# EAGLE design robotic_arm (EAGLE 9.3.1)
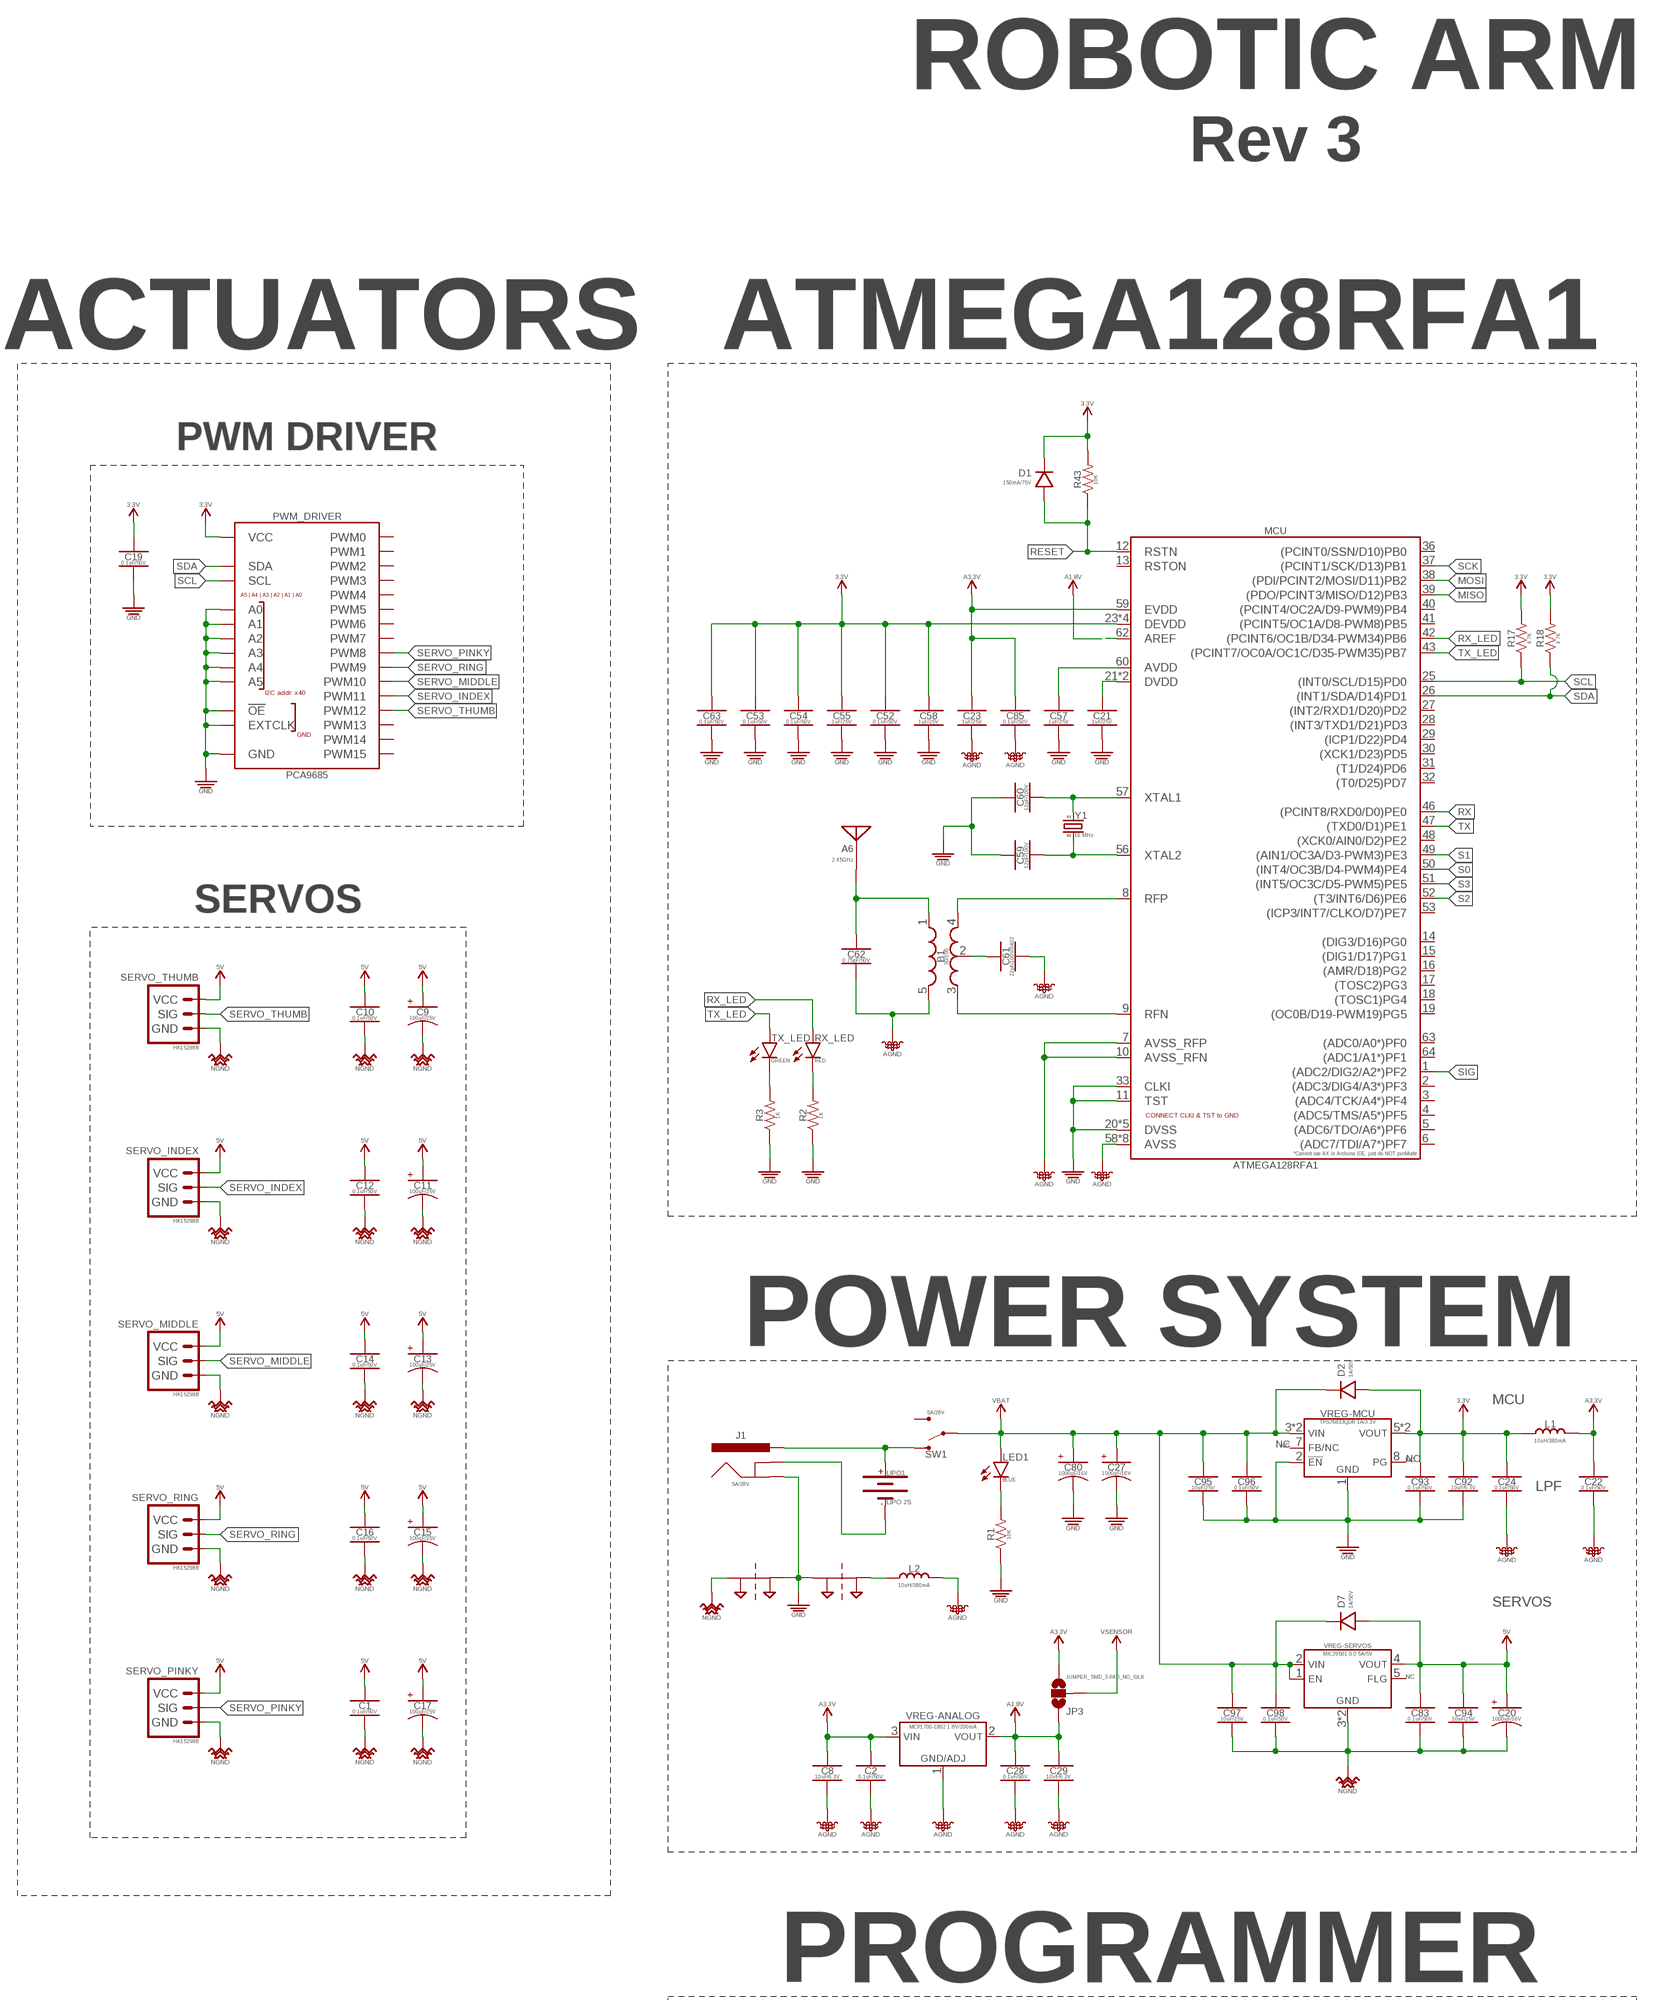
[diagram p0: schematic, sheet 1, part 1 of 3]
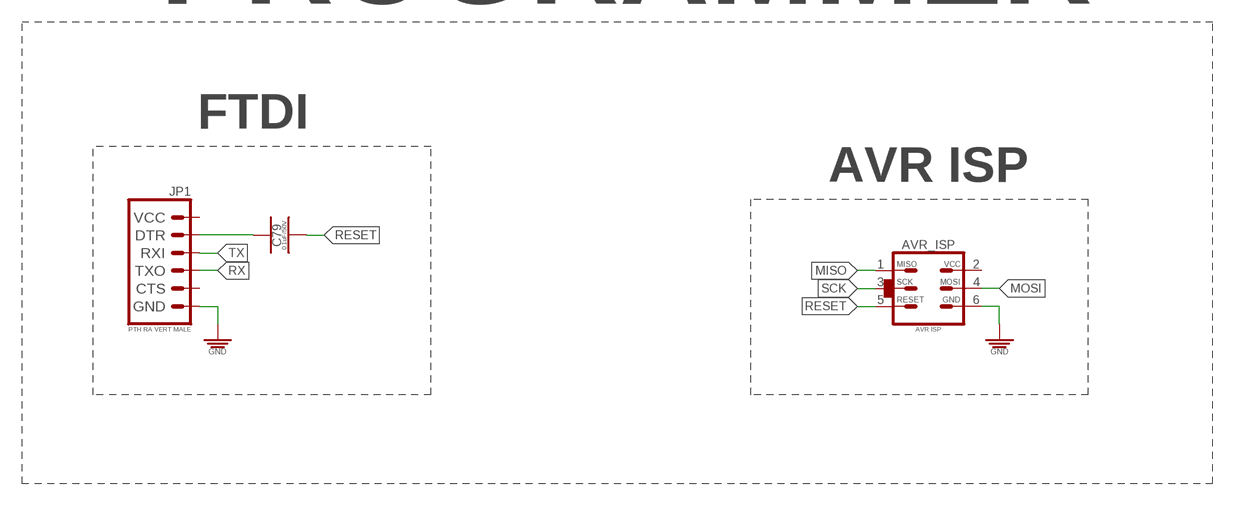
[diagram p1: schematic, sheet 1, part 2 of 3]
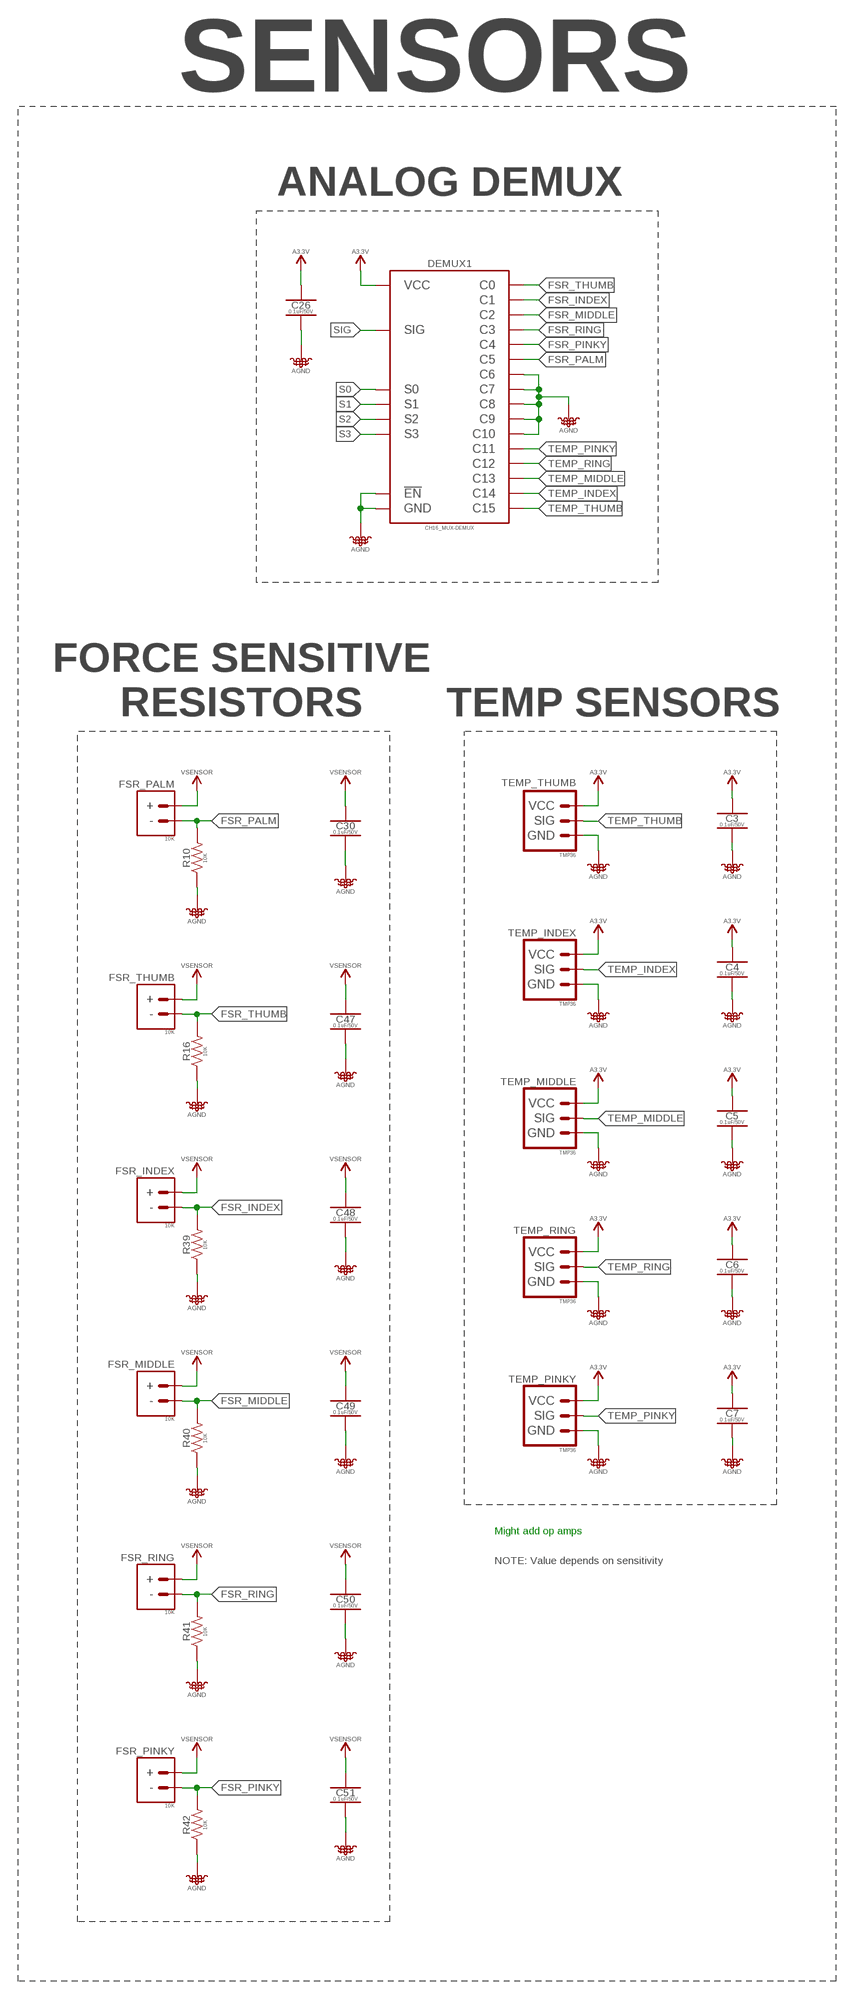
[diagram p2: schematic, sheet 1, part 3 of 3]

## Parts
A6  2.45GHz  ANTENNA_SMD_CHP-2.45GHZ-0.5DBI-3W  [ANTC6522X100]
AVR_ISP  AVR ISP  AVR_SPI_PRG_6_PTH_VERT_MALE_2.54MM  [HDRV6W64P254_2X3_762X508X838B]
B1  50/100  BALUN_SMD-0805_UNBAL/BAL-50/100  [RESCAXE65P200X125X95-6]
C1  0.1uF/50V  0.1UF_SMD-0402_50V-10%  [CAPC1005X55_SMD-0402]
C2  0.1uF/50V  0.1UF_SMD-0402_50V-10%  [CAPC1005X55_SMD-0402]
C3  0.1uF/50V  0.1UF_SMD-0402_50V-10%  [CAPC1005X55_SMD-0402]
C4  0.1uF/50V  0.1UF_SMD-0402_50V-10%  [CAPC1005X55_SMD-0402]
C5  0.1uF/50V  0.1UF_SMD-0402_50V-10%  [CAPC1005X55_SMD-0402]
C6  0.1uF/50V  0.1UF_SMD-0402_50V-10%  [CAPC1005X55_SMD-0402]
C7  0.1uF/50V  0.1UF_SMD-0402_50V-10%  [CAPC1005X55_SMD-0402]
C8  10uF/6.3V  10UF_CER_SMD-0402_6.3V-20%  [CAPC1005X55_SMD-0402]
C9  100uF/25V  100UF-POLARIZED_PTH_25V-20%_D5-LS2-H11  [CAPPRD200W50D500H1100B]
C10  0.1uF/50V  0.1UF_SMD-0402_50V-10%  [CAPC1005X55_SMD-0402]
C11  100uF/25V  100UF-POLARIZED_PTH_25V-20%_D5-LS2-H11  [CAPPRD200W50D500H1100B]
C12  0.1uF/50V  0.1UF_SMD-0402_50V-10%  [CAPC1005X55_SMD-0402]
C13  100uF/25V  100UF-POLARIZED_PTH_25V-20%_D5-LS2-H11  [CAPPRD200W50D500H1100B]
C14  0.1uF/50V  0.1UF_SMD-0402_50V-10%  [CAPC1005X55_SMD-0402]
C15  100uF/25V  100UF-POLARIZED_PTH_25V-20%_D5-LS2-H11  [CAPPRD200W50D500H1100B]
C16  0.1uF/50V  0.1UF_SMD-0402_50V-10%  [CAPC1005X55_SMD-0402]
C17  100uF/25V  100UF-POLARIZED_PTH_25V-20%_D5-LS2-H11  [CAPPRD200W50D500H1100B]
C19  0.1uF/50V  0.1UF_SMD-0402_50V-10%  [CAPC1005X55_SMD-0402]
C20  1000uF/16V  1000UF-POLARIZED_PTH_16V-20%_D8-LS3.5-H20  [CAPPRD350W60D800H2000B]
C21  1uF/25V  1UF_CER_SMD-0402_25V-10%  [CAPC1005X55_SMD-0402]
C22  0.1uF/50V  0.1UF_SMD-0402_50V-10%  [CAPC1005X55_SMD-0402]
C23  1uF/25V  1UF_CER_SMD-0402_25V-10%  [CAPC1005X55_SMD-0402]
C24  0.1uF/50V  0.1UF_SMD-0402_50V-10%  [CAPC1005X55_SMD-0402]
C26  0.1uF/50V  0.1UF_SMD-0402_50V-10%  [CAPC1005X55_SMD-0402]
C27  1000uF/16V  1000UF-POLARIZED_PTH_16V-20%_D8-LS3.5-H20  [CAPPRD350W60D800H2000B]
C28  0.1uF/50V  0.1UF_SMD-0402_50V-10%  [CAPC1005X55_SMD-0402]
C29  10uF/6.3V  10UF_CER_SMD-0402_6.3V-20%  [CAPC1005X55_SMD-0402]
C30  0.1uF/50V  0.1UF_SMD-0402_50V-10%  [CAPC1005X55_SMD-0402]
C47  0.1uF/50V  0.1UF_SMD-0402_50V-10%  [CAPC1005X55_SMD-0402]
C48  0.1uF/50V  0.1UF_SMD-0402_50V-10%  [CAPC1005X55_SMD-0402]
C49  0.1uF/50V  0.1UF_SMD-0402_50V-10%  [CAPC1005X55_SMD-0402]
C50  0.1uF/50V  0.1UF_SMD-0402_50V-10%  [CAPC1005X55_SMD-0402]
C51  0.1uF/50V  0.1UF_SMD-0402_50V-10%  [CAPC1005X55_SMD-0402]
C52  0.1uF/50V  0.1UF_SMD-0402_50V-10%  [CAPC1005X55_SMD-0402]
C53  0.1uF/50V  0.1UF_SMD-0402_50V-10%  [CAPC1005X55_SMD-0402]
C54  0.1uF/50V  0.1UF_SMD-0402_50V-10%  [CAPC1005X55_SMD-0402]
C55  1uF/25V  1UF_CER_SMD-0402_25V-10%  [CAPC1005X55_SMD-0402]
C57  1uF/25V  1UF_CER_SMD-0402_25V-10%  [CAPC1005X55_SMD-0402]
C58  1uF/25V  1UF_CER_SMD-0402_25V-10%  [CAPC1005X55_SMD-0402]
C59  12pF/100V  12PF_SMD-0402_100V-5%  [CAPC1005X55_SMD-0402]
C60  12pF/100V  12PF_SMD-0402_100V-5%  [CAPC1005X55_SMD-0402]
C61  22pF/100V/0402  22PF_CER_SMD-0402-100V-5%  [CAPC1005X55_SMD-0402]
C62  0.75pF/50V  0.75PF_CER_SMD-0402_50V-33%  [CAPC1005X55_SMD-0402]
C63  0.1uF/50V  0.1UF_SMD-0402_50V-10%  [CAPC1005X55_SMD-0402]
C79  0.1uF/50V  0.1UF_SMD-0402_50V-10%  [CAPC1005X55_SMD-0402]
C80  1000uF/16V  1000UF-POLARIZED_PTH_16V-20%_D8-LS3.5-H20  [CAPPRD350W60D800H2000B]
C83  0.1uF/50V  0.1UF_SMD-0402_50V-10%  [CAPC1005X55_SMD-0402]
C85  0.1uF/50V  0.1UF_SMD-0402_50V-10%  [CAPC1005X55_SMD-0402]
C92  10uF/6.3V  10UF_CER_SMD-0402_6.3V-20%  [CAPC1005X55_SMD-0402]
C93  0.1uF/50V  0.1UF_SMD-0402_50V-10%  [CAPC1005X55_SMD-0402]
C94  10uF/25V  10UF_CER_SMD-0805_25V-10%  [CAPC2012X95_SMD-0805]
C95  10uF/25V  10UF_CER_SMD-0805_25V-10%  [CAPC2012X95_SMD-0805]
C96  0.1uF/50V  0.1UF_SMD-0402_50V-10%  [CAPC1005X55_SMD-0402]
C97  10uF/25V  10UF_CER_SMD-0805_25V-10%  [CAPC2012X95_SMD-0805]
C98  0.1uF/50V  0.1UF_SMD-0402_50V-10%  [CAPC1005X55_SMD-0402]
D1  150mA/75V  GENERAL-PURPOSE_SMD-0402_GP_150MA-75V  [DFN100X60X55-2]
D2  1A/50V  GENERAL-PURPOSE_SMD_GP_1A-50V  [SODFL3516X170]
D7  1A/50V  GENERAL-PURPOSE_SMD_GP_1A-50V  [SODFL3516X170]
DEMUX1  CH16_MUX-DEMUX  CD74HC4067-SM96_16:1_MUX-DEMUX_SOP-24_16:1-MUX-DEMUX  [SOP65P780X200-24]
FSR_INDEX  10K  FORCE-SENSITIVE-RESISTOR_SENSOR_FSR-5MM_0530470210_VERT-MALE_PITCH-1.25MM  [_MOLEX-0530470210_VERT_PITCH-1.25MM]
FSR_MIDDLE  10K  FORCE-SENSITIVE-RESISTOR_SENSOR_FSR-5MM_0530470210_VERT-MALE_PITCH-1.25MM  [_MOLEX-0530470210_VERT_PITCH-1.25MM]
FSR_PALM  10K  FORCE-SENSITIVE-RESISTOR_SENSOR_FSR-5MM_0530470210_VERT-MALE_PITCH-1.25MM  [_MOLEX-0530470210_VERT_PITCH-1.25MM]
FSR_PINKY  10K  FORCE-SENSITIVE-RESISTOR_SENSOR_FSR-5MM_0530470210_VERT-MALE_PITCH-1.25MM  [_MOLEX-0530470210_VERT_PITCH-1.25MM]
FSR_RING  10K  FORCE-SENSITIVE-RESISTOR_SENSOR_FSR-5MM_0530470210_VERT-MALE_PITCH-1.25MM  [_MOLEX-0530470210_VERT_PITCH-1.25MM]
FSR_THUMB  10K  FORCE-SENSITIVE-RESISTOR_SENSOR_FSR-5MM_0530470210_VERT-MALE_PITCH-1.25MM  [_MOLEX-0530470210_VERT_PITCH-1.25MM]
J1  5A/28V  POWER_JACK-BARREL_ID2.1MM-OD5.5MM_PTH_ID2.1MM-OD5.5MM  [POWER_JACK_PTH_ID2.1MM-OD5.5MM]
JP1  PTH RA VERT MALE  FTDI_PTH_RA_MALE_2.54MM  [HDRRA6W64P254_1X6_1524X254X254B_FTDI]
JP3  JUMPER_SMD_3-PAD_NO_SILK  [SMT-JUMPER_3_NO_SILK]
L1  10uH/380mA  10UH_SMD-0603_0.38A-0.468OHM-10%  [INDC1608X60-0603]
L2  10uH/380mA  10UH_SMD-0603_0.38A-0.468OHM-10%  [INDC1608X60-0603]
LED1  BLUE  LED_SMD-0402_DISCRETE_BLUE  [LEDC1005X40_LED-0402]
LIPO1  LIPO 2S  BATTERY_LIPO_2S_2S_7.4V_PTH-PADS_AWG-18  [1X02_WIRE_CONNECTOR_AWG-18]
MCU  ATMEGA128RFA1  ATMEGA128RFA1_VFQFN-64_EXPOSED-PAD  [QFN50P900X900X90-64]
NOISE_BR  NET_BRIDGE  [NET_BRIDGE]
NOISE_BR1  NET_BRIDGE  [NET_BRIDGE]
PWM_DRIVER  PCA9685  PCA9685_16-CH_12-BIT_PWM-DRIVER_TSSOP-28_PWM-DRIVER_16CH  [SOP65P650X110-28]
R1  10K  10KΩ_SMD-0402_1/16W-5%  [RESC1005X35_SMD-0402]
R2  1K  1KΩ_SMD-0402_1/16W-5%  [RESC1005X35_SMD-0402]
R3  1K  1KΩ_SMD-0402_1/16W-5%  [RESC1005X35_SMD-0402]
R10  10K  10KΩ_SMD-0402_1/16W-5%  [RESC1005X35_SMD-0402]
R16  10K  10KΩ_SMD-0402_1/16W-5%  [RESC1005X35_SMD-0402]
R17  4.7K  4.7KΩ_SMD-0402_1/16W-5%  [RESC1005X35_SMD-0402]
R18  4.7K  4.7KΩ_SMD-0402_1/16W-5%  [RESC1005X35_SMD-0402]
R39  10K  10KΩ_SMD-0402_1/16W-5%  [RESC1005X35_SMD-0402]
R40  10K  10KΩ_SMD-0402_1/16W-5%  [RESC1005X35_SMD-0402]
R41  10K  10KΩ_SMD-0402_1/16W-5%  [RESC1005X35_SMD-0402]
R42  10K  10KΩ_SMD-0402_1/16W-5%  [RESC1005X35_SMD-0402]
R43  10K  10KΩ_SMD-0402_1/16W-5%  [RESC1005X35_SMD-0402]
RX_LED  RED  LED_SMD-0402_DISCRETE_RED  [LEDC1005X40_LED-0402]
SERVO_INDEX  HK15298B  SERVO_HK15298B_PTH_VERT_MALE_2.54MM  [HDRV3W64P254_1X3_762X254X838B]
SERVO_MIDDLE  HK15298B  SERVO_HK15298B_PTH_VERT_MALE_2.54MM  [HDRV3W64P254_1X3_762X254X838B]
SERVO_PINKY  HK15298B  SERVO_HK15298B_PTH_VERT_MALE_2.54MM  [HDRV3W64P254_1X3_762X254X838B]
SERVO_RING  HK15298B  SERVO_HK15298B_PTH_VERT_MALE_2.54MM  [HDRV3W64P254_1X3_762X254X838B]
SERVO_THUMB  HK15298B  SERVO_HK15298B_PTH_VERT_MALE_2.54MM  [HDRV3W64P254_1X3_762X254X838B]
SW1  5A/28V  SWITCH_SPDT_VERT_PTH_5A-28V_13L-7W_  [SW_TOGGLE_SPDT_5A-28V_13L-7W]
TEMP_INDEX  TMP36  TEMPERATURE-SENSOR_TMP36_TMP36_PTH_VERT  [_MOLEX-0530470310_VERT_PITCH-1.25MM]
TEMP_MIDDLE  TMP36  TEMPERATURE-SENSOR_TMP36_TMP36_PTH_VERT  [_MOLEX-0530470310_VERT_PITCH-1.25MM]
TEMP_PINKY  TMP36  TEMPERATURE-SENSOR_TMP36_TMP36_PTH_VERT  [_MOLEX-0530470310_VERT_PITCH-1.25MM]
TEMP_RING  TMP36  TEMPERATURE-SENSOR_TMP36_TMP36_PTH_VERT  [_MOLEX-0530470310_VERT_PITCH-1.25MM]
TEMP_THUMB  TMP36  TEMPERATURE-SENSOR_TMP36_TMP36_PTH_VERT  [_MOLEX-0530470310_VERT_PITCH-1.25MM]
TX_LED  GREEN  LED_SMD-0402_DISCRETE_GREEN  [LEDC1005X40_LED-0402]
VREG-ANALOG  MCP1700-1802 1.8V/200mA  VREG_LINEAR_MCP1700_MCP1700T-1802_1.8V-200MA_SOT-23  [SOT95P237X112-3_SOT-23-3]
VREG-MCU  TPS76833QDR 1A/3.3V  VREG_TPS768XX_ULDO_FAST-TRANSIENT_TPS76833QDR_1A-3.3V  [SOIC127P600X265-8]
VREG-SERVOS  MIC29501-5.0 5A/5V  VREG_MIC29501-5.0_LINEAR_ULDO_5A-5V_MC29501-5.0_5A-5V  [TO170P1363X457-6]
Y1  16 MHz  CRYSTAL_ABM3B_16MHZ_18PF  [OSCCC500X320X110_CRYSTAL]

## Nets
3.3V: C19.1 C24.1 C52.1 C53.1 C54.1 C55.1 C58.1 C63.1 C92.1 C93.1 D1.K D2.A L1.1 MCU.23(DEVDD) MCU.34(DEVDD) MCU.44(DEVDD) MCU.54(DEVDD) PWM_DRIVER.28(VCC) R17.2 R18.2 R43.2 VREG-MCU.5(VOUT) VREG-MCU.6(VOUT)
5V: C1.1 C9.A C10.1 C11.A C12.1 C13.A C14.1 C15.A C16.1 C17.A C20.A C83.1 C94.1 D7.A SERVO_INDEX.VCC SERVO_MIDDLE.VCC SERVO_PINKY.VCC SERVO_RING.VCC SERVO_THUMB.VCC VREG-SERVOS.4(VOUT)
+: J1.PWR LIPO1.+ SW1.S1
-: J1.GND_BATTERY LIPO1.-
A1.8V: C28.1 C29.1 JP3.1 MCU.62(AREF) VREG-ANALOG.2(VO)
A3.3V: C2.1 C3.1 C4.1 C5.1 C6.1 C7.1 C8.1 C22.1 C23.1 C26.1 C85.1 DEMUX1.24(VCC) JP3.3 L1.2 MCU.59(EVDD) TEMP_INDEX.VCC TEMP_MIDDLE.VCC TEMP_PINKY.VCC TEMP_RING.VCC TEMP_THUMB.VCC VREG-ANALOG.3(VI)
AGND: B1.5(GND) C2.2 C3.2 C4.2 C5.2 C6.2 C7.2 C8.2 C22.2 C23.2 C24.2 C26.2 C28.2 C29.2 C30.2 C47.2 C48.2 C49.2 C50.2 C51.2 C61.2 C62.2 C85.2 DEMUX1.2(C7) DEMUX1.3(C6) DEMUX1.12(GND) DEMUX1.15(!EN) DEMUX1.21(C10) DEMUX1.22(C9) DEMUX1.23(C8) L2.2 MCU.7(AVSS_RFP) MCU.10(AVSS_RFN) MCU.58(AVSS) MCU.61(AVSS) MCU.EP(AVSS) MCU.P$1(AVSS) MCU.P$2(AVSS) MCU.P$3(AVSS) MCU.P$4(AVSS) MCU.P$5(AVSS) R10.1 R16.1 R39.1 R40.1 R41.1 R42.1 TEMP_INDEX.GND TEMP_MIDDLE.GND TEMP_PINKY.GND TEMP_RING.GND TEMP_THUMB.GND VREG-ANALOG.1(GND)
FSR_INDEX: DEMUX1.8(C1) FSR_INDEX.2(-) R39.2
FSR_MIDDLE: DEMUX1.7(C2) FSR_MIDDLE.2(-) R40.2
FSR_PALM: DEMUX1.4(C5) FSR_PALM.2(-) R10.2
FSR_PINKY: DEMUX1.5(C4) FSR_PINKY.2(-) R42.2
FSR_RING: DEMUX1.6(C3) FSR_RING.2(-) R41.2
FSR_THUMB: DEMUX1.9(C0) FSR_THUMB.2(-) R16.2
GND: AVR_ISP.GND C19.2 C21.2 C27.K C52.2 C53.2 C54.2 C55.2 C57.2 C58.2 C59.1 C60.1 C63.2 C80.K C92.2 C93.2 C95.2 C96.2 J1.GND_JACK JP1.GND MCU.11(TST) MCU.20(DVSS) MCU.24(DVSS) MCU.33(CLKI) MCU.35(DVSS) MCU.45(DVSS) MCU.55(DVSS) NOISE_BR1.P$1 NOISE_BR.P$2 PWM_DRIVER.1(A0) PWM_DRIVER.2(A1) PWM_DRIVER.3(A2) PWM_DRIVER.4(A3) PWM_DRIVER.5(A4) PWM_DRIVER.14(GND) PWM_DRIVER.23(!OE) PWM_DRIVER.24(A5) PWM_DRIVER.25(EXTCLK) R1.1 R2.1 R3.1 VREG-MCU.1(GND) VREG-MCU.2(!EN)
MISO: AVR_ISP.MISO MCU.39((PDO/PCINT3/MISO/D12)PB3)
MOSI: AVR_ISP.MOSI MCU.38((PDI/PCINT2/MOSI/D11)PB2)
N$1: L2.1 NOISE_BR1.P$2
N$2: LED1.K R1.2
N$3: R3.2 TX_LED.K
N$5: R2.2 RX_LED.K
N$10: C21.1 MCU.21(DVDD) MCU.22(DVDD)
N$11: C57.1 MCU.60(AVDD)
N$30: C60.2 MCU.57(XTAL1) Y1.1(XTAL1)
N$32: B1.3(OUT1) MCU.9(RFN)
N$33: B1.4(OUT2) MCU.8(RFP)
N$34: B1.2(GND) C61.1
N$35: C59.2 MCU.56(XTAL2) Y1.3(XTAL2)
N$39: A6.1(SIGNAL) B1.1(IN) C62.1
N$41: C79.1 JP1.DTR
NGND: C1.2 C9.K C10.2 C11.K C12.2 C13.K C14.2 C15.K C16.2 C17.K C20.K C83.2 C94.2 C97.2 C98.2 NOISE_BR.P$1 SERVO_INDEX.GND SERVO_MIDDLE.GND SERVO_PINKY.GND SERVO_RING.GND SERVO_THUMB.GND VREG-SERVOS.3(GND) VREG-SERVOS.TAB(GND)
RESET: AVR_ISP.RESET C79.2 D1.A MCU.12(RSTN) R43.1
RX: JP1.TXO MCU.46((PCINT8/RXD0/D0)PE0)
RX_LED: MCU.42((PCINT6/OC1B/D34-PWM34)PB6) RX_LED.A
S0: DEMUX1.10(S0) MCU.50((INT4/OC3B/D4-PWM4)PE4)
S1: DEMUX1.11(S1) MCU.49((AIN1/OC3A/D3-PWM3)PE3)
S2: DEMUX1.14(S2) MCU.52((T3/INT6/D6)PE6)
S3: DEMUX1.13(S3) MCU.51((INT5/OC3C/D5-PWM5)PE5)
SCK: AVR_ISP.SCK MCU.37((PCINT1/SCK/D13)PB1)
SCL: MCU.25((INT0/SCL/D15)PD0) PWM_DRIVER.26(SCL) R17.1
SDA: MCU.26((INT1/SDA/D14)PD1) PWM_DRIVER.27(SDA) R18.1
SERVO_INDEX: PWM_DRIVER.18(PWM11) SERVO_INDEX.SIG
SERVO_MIDDLE: PWM_DRIVER.17(PWM10) SERVO_MIDDLE.SIG
SERVO_PINKY: PWM_DRIVER.15(PWM8) SERVO_PINKY.SIG
SERVO_RING: PWM_DRIVER.16(PWM9) SERVO_RING.SIG
SERVO_THUMB: PWM_DRIVER.19(PWM12) SERVO_THUMB.SIG
SIG: DEMUX1.1(SIG) MCU.1((ADC2/DIG2/A2*)PF2)
TEMP_INDEX: DEMUX1.17(C14) TEMP_INDEX.SIG
TEMP_MIDDLE: DEMUX1.18(C13) TEMP_MIDDLE.SIG
TEMP_PINKY: DEMUX1.20(C11) TEMP_PINKY.SIG
TEMP_RING: DEMUX1.19(C12) TEMP_RING.SIG
TEMP_THUMB: DEMUX1.16(C15) TEMP_THUMB.SIG
TX: JP1.RXI MCU.47((TXD0/D1)PE1)
TX_LED: MCU.43((PCINT7/OC0A/OC1C/D35-PWM35)PB7) TX_LED.A
VBAT: C27.A C80.A C95.1 C96.1 C97.1 C98.1 D2.K D7.K LED1.A SW1.P VREG-MCU.3(VIN) VREG-MCU.4(VIN) VREG-SERVOS.1(EN) VREG-SERVOS.2(VIN)
VSENSOR: C30.1 C47.1 C48.1 C49.1 C50.1 C51.1 FSR_INDEX.1(+) FSR_MIDDLE.1(+) FSR_PALM.1(+) FSR_PINKY.1(+) FSR_RING.1(+) FSR_THUMB.1(+) JP3.2
Unconnected: AVR_ISP.VCC JP1.CTS JP1.VCC MCU.2((ADC3/DIG4/A3*)PF3) MCU.3((ADC4/TCK/A4*)PF4) MCU.4((ADC5/TMS/A5*)PF5) MCU.5((ADC6/TDO/A6*)PF6) MCU.6((ADC7/TDI/A7*)PF7) MCU.13(RSTON) MCU.14((DIG3/D16)PG0) MCU.15((DIG1/D17)PG1) MCU.16((AMR/D18)PG2) MCU.17((TOSC2)PG3) MCU.18((TOSC1)PG4) MCU.19((OC0B/D19-PWM19)PG5) MCU.27((INT2/RXD1/D20)PD2) MCU.28((INT3/TXD1/D21)PD3) MCU.29((ICP1/D22)PD4) MCU.30((XCK1/D23)PD5) MCU.31((T1/D24)PD6) MCU.32((T0/D25)PD7) MCU.36((PCINT0/SSN/D10)PB0) MCU.40((PCINT4/OC2A/D9-PWM9)PB4) MCU.41((PCINT5/OC1A/D8-PWM8)PB5) MCU.48((XCK0/AIN0/D2)PE2) MCU.53((ICP3/INT7/CLKO/D7)PE7) MCU.63((ADC0/A0*)PF0) MCU.64((ADC1/A1*)PF1) PWM_DRIVER.6(PWM0) PWM_DRIVER.7(PWM1) PWM_DRIVER.8(PWM2) PWM_DRIVER.9(PWM3) PWM_DRIVER.10(PWM4) PWM_DRIVER.11(PWM5) PWM_DRIVER.12(PWM6) PWM_DRIVER.13(PWM7) PWM_DRIVER.20(PWM13) PWM_DRIVER.21(PWM14) PWM_DRIVER.22(PWM15) SW1.S2 VREG-MCU.7(FB/NC) VREG-MCU.8(PG) VREG-SERVOS.5(FLG)

## Notes on the sheet
- TRANSMISSION OF TOUCH VR
- ROBOTIC ARM
- Rev 3
- ACTUATORS | ATMEGA128RFA1 | SENSORS
- PWM DRIVER | ANALOG DEMUX
- SERVOS
- FORCE SENSITIVE
  RESISTORS
- TEMP SENSORS
- POWER SYSTEM
- MCU
- NC
- NC
- LPF
- SERVOS
- NC
- Might add op amps
- NOTE: Value depends on sensitivity
- PROGRAMMER
- FTDI
- AVR ISP

## Library data of the parts
A6 = _radio_frequency:ANTENNA: Chip antenna Single endded antenna. Common with smaller chip antennas. CHIP4 package is the GPS Chip Antenna SKU: GPS-08418. CHIP5 package is 2.4GHz chip antenna SKU: WRL-00144.; DATASHEET: https://linxtechnologies.com/wp/wp-content/uploads/ant-fff-chp-x.pdf; DIST: Digikey; DISTLINK: https://www.digikey.com/products/en?keywords=ANT-2.45-CHPCT-ND; DISTPN: ANT-2.45-CHPCT-ND; MFR: Linx Technologies Inc.; MPN: ANT-2.45-CHP-T
AVR_ISP = _connectors:AVR_SPI_PRG_6: AVR ISP 6 Pin This is the reduced ISP connector for AVR programming. Common on Arduino. This footprint will take up less PCB space and can be used with a 10-pin to 6-pin adapter such as SKU: BOB-08508; DATASHEET: https://s3.amazonaws.com/catalogspreads-pdf/PAGE112-113%20.100%20MALE%20HDR.pdf; DIST: Digikey; DISTLINK: https://www.digikey.com/products/en?keywords=S2012E-03-ND; DISTPN: S2012E-03-ND; MFR: Sullins Connector Solutions; MPN: PEC03DAAN
B1 = _radio_frequency:BALUN: 0805 footprint balun- Ember 351/357; DATASHEET: http://katalog.we-online.de/pbs/datasheet/748421245.pdf; DIST: Digikey; DISTLINK: https://www.digikey.com/products/en?keywords=732-2230-6-ND; DISTPN: 732-2230-6-ND; MFR: Wurth Electronics Inc.; MPN: 748421245
C1-C7 C10 C12 C14 C16 C19 C22 C24 C26 C28 C30 C47-C54 C63 C79 C83 C85 C93 C96 C98 = _capacitors:0.1UF; DATASHEET: https://product.tdk.com/info/en/catalog/datasheets/mlcc_commercial_soft_en.pdf; DIST: Digikey; DISTLINK: https://www.digikey.com/products/en?keywords=445-173610-1-ND; DISTPN: 445-173610-1-ND; MFR: TDK Corporation; MPN: C1005X7R1H104K050BE
C8 C29 C92 = _capacitors:10UF; DATASHEET: https://www.murata.com/~/media/webrenewal/support/library/catalog/products/capacitor/mlcc/c02e.ashx; DIST: Digikey; DISTLINK: https://www.digikey.com/products/en?keywords=490-13233-1-ND; DISTPN: 490-13233-1-ND; MFR: Murata Electronics North America; MPN: GRM155C80J106ME11D
C9 C11 C13 C15 C17 = _capacitors:100UF-POLARIZED; DATASHEET: UVY1E101MDD; DIST: Digikey; DISTLINK: https://www.digikey.com/products/en?keywords=UVY1E101MDD-ND; DISTPN: UVY1E101MDD-ND; MFR: Nichicon; MPN: UVY1E101MDD
C20 C27 C80 = _capacitors:1000UF-POLARIZED; DATASHEET: EKZM160ELL102MH20D; DIST: Digikey; DISTLINK: https://www.digikey.com/products/en?keywords=565-3567-ND; DISTPN: 565-3567-ND; MFR: United Chemi-Con; MPN: EKZM160ELL102MH20D
C21 C23 C55 C57 C58 = _capacitors:1UF; DATASHEET: https://product.tdk.com/info/en/catalog/datasheets/mlcc_commercial_lowprofile_en.pdf; DIST: Digikey; DISTLINK: https://www.digikey.com/products/en?keywords=445-13185-1-ND; DISTPN: 445-13185-1-ND; MFR: TDK Corporation; MPN: CGB2A1X5R1E105K033BC
C59 C60 = _capacitors:12PF; DATASHEET: http://www.yuden.co.jp/productdata/catalog/mlcc06_e.pdf; DIST: Digikey; DISTLINK: https://www.digikey.com/products/en?keywords=587-5001-1-ND; DISTPN: 587-5001-1-ND; MFR: Taiyo Yuden; MPN: HMK105CG120JV-F
C61 = _capacitors:22PF; DATASHEET: http://www.vishay.com/docs/45071/vjhifreq.pdf; DIST: Digikey; DISTLINK: https://www.digikey.com/products/en?keywords=720-1286-1-ND; DISTPN: 720-1286-1-ND; MFR: Vishay Vitramon; MPN: VJ0402D220JXBAJ
C62 = _capacitors:0.75PF; DATASHEET: https://product.tdk.com/info/en/documents/chara_sheet/C1005C0G1HR75C050BA.pdf; DIST: Digikey; DISTLINK: https://www.digikey.com/products/en?keywords=445-4853-1-ND; DISTPN: 445-4853-1-ND; MFR: TDK Corporation; MPN: C1005C0G1HR75C050BA
C94 C95 C97 = _capacitors:10UF; DATASHEET: http://search.murata.co.jp/Ceramy/image/img/A01X/G101/ENG/GRM21BR61E106MA73-01.pdf; DIST: Digikey; DISTLINK: https://www.digikey.com/products/en?keywords=490-10748-1-ND; DISTPN: 490-10748-1-ND; MFR: Murata Electronics North America; MPN: GRM21BR61E106MA73L
D1 = _discrete_semiconductors:GENERAL-PURPOSE; DATASHEET: http://www.comchiptech.com/cms/UserFiles/CDSQR4148-HF-RevC213424.pdf; DIST: Digikey; DISTLINK: https://www.digikey.com/products/en?keywords=641-1677-1-ND; DISTPN: 641-1677-1-ND; MFR: Comchip Technology; MPN: CDSQR4148-HF
D2 D7 = _discrete_semiconductors:GENERAL-PURPOSE; DATASHEET: http://www.comchiptech.com/cms/UserFiles/CGRKM4001-HF%20Thru.%20CGRKM4007-HF%20RevG.pdf; DIST: Digikey; DISTLINK: https://www.digikey.com/products/en?keywords=641-1511-1-ND; DISTPN: 641-1511-1-ND; MFR: Comchip Technology; MPN: CGRKM4001-HF
DEMUX1 = _special:CD74HC4067-SM96_16:1_MUX-DEMUX; DATASHEET: http://www.ti.com/lit/ds/symlink/cd74hc4067.pdf; DIST: Digikey; DISTLINK: https://www.digikey.com/products/en?keywords=296-9226-1-ND; DISTPN: 296-9226-1-ND; MFR: Texas Instruments; MPN: CD74HC4067SM96
FSR_INDEX FSR_MIDDLE FSR_PALM FSR_PINKY FSR_RING FSR_THUMB = _sensors:FORCE-SENSITIVE-RESISTOR_SENSOR; DATASHEET: https://cdn2.hubspot.net/hubfs/3899023/Interlinkelectronics%20November2017/Docs/Datasheet_FSR.pdf; DATASHEET_CONNECTOR1: https://www.molex.com/pdm_docs/sd/530470210_sd.pdf; DATASHEET_CONNECTOR2: https://www.molex.com/pdm_docs/sd/510210700_sd.pdf; DATASHEET_CRIMP: https://www.molex.com/pdm_docs/sd/500798000_sd.pdf; DIST: Digikey; DISTLINK: https://www.digikey.com/products/en?keywords=1027-1014-ND; DISTLINK_CONNECTOR1: https://www.digikey.com/products/en?keywords=WM1731-ND; DISTLINK_CONNECTOR2: https://www.digikey.com/products/en?keywords=WM1720-ND; DISTLINK_CRIMP: https://www.digikey.com/products/en?keywords=WM1142CT-ND; DISTPN: 1027-1014-ND; DISTPN_CONNECTOR1: WM1731-ND; DISTPN_CONNECTOR2: WM1720-ND; DISTPN_CRIMP: WM1142CT-ND; DIST_CONNECTOR1: Digikey; DIST_CONNECTOR2: Digikey; DIST_CRIMP: Digikey; MFR: Spectra Symbol; MFR_CONNECTOR1: Molex, LLC; MFR_CONNECTOR2: Molex, LLC; MFR_CRIMP: Molex, LLC; MPN: FS-L-0095-103-ST; MPN_CONNECTOR1: 0530470210; MPN_CONNECTOR2: 51021-0200; MPN_CRIMP: 0500798000
J1 = _connectors:POWER_JACK-BARREL_ID2.1MM-OD5.5MM; DATASHEET: https://www.cui.com/product/resource/pj-102a.pdf; DIST: Digikey; DISTLINK: https://www.digikey.com/products/en?keywords=CP-102A-ND; DISTPN: CP-102A-ND; MFR: CUI Inc.; MPN: PJ-102A
JP1 = _connectors:FTDI: FTDI Basic header with labels; DATASHEET: https://media.digikey.com/pdf/Data%20Sheets/Sparkfun%20PDFs/DEV-09873_Web.pdf; DATASHEET_CABLE: http://www.assmann-wsw.com/fileadmin/datasheets/ASS_7131_CA.pdf; DIST: Digikey; DISTLINK: https://www.digikey.com/products/en?keywords=1568-1104-ND; DISTLINK_CABLE: https://www.digikey.com/products/en?keywords=AE1450-ND; DISTLINK_CONNECTOR: https://www.digikey.com/products/en?keywords=S1112E-06-ND; DISTPN: 1568-1104-ND; DISTPN_CABLE: AE1450-ND; DISTPN_CONNECTOR: S1112E-06-ND; DIST_CABLE: Digikey; DIST_CONNECTOR: Digikey; MFR: SparkFun Electronics; MFR_CABLE: Assmann WSW Components; MFR_CONNECTOR: Sullins Connector Solutions; MPN: DEV-09873; MPN_CABLE: AK672M/2-1; MPN_CONNECTOR: PEC06SBAN; MPN_DATASHEET: https://s3.amazonaws.com/catalogspreads-pdf/PAGE112-113%20.100%20MALE%20HDR.pdf
JP3 = _connectors:JUMPER_SMD_3-PAD_NO: Normally open jumper This jumper has three pads in close proximity to each other. Apply solder to close the connection(s).
L1 L2 = _inductors:10UH; DATASHEET: http://ds.yuden.co.jp/TYCOMPAS/ut/detail.do?productNo=CBMF1608T100K&fileName=CBMF1608T100K_SS&mode=specSheetDownload; DIST: Digikey; DISTLINK: https://www.digikey.com/products/en?keywords=587-1720-1-ND; DISTPN: 587-1720-1-ND; MFR: Taiyo Yuden; MPN: Taiyo Yuden
LED1 = _leds:LED; DATASHEET: https://www.bivar.com/portals/0/products/SM0402BWC.pdf; DIST: Digikey; DISTLINK: https://www.digikey.com/products/en?keywords=492-2203-1-ND; DISTPN: 492-2203-1-ND; MFR: Bivar Inc.; MPN: SM0402BWC
LIPO1 = _batteries:BATTERY_LIPO_2S
MCU = _ic_microcontrollers:ATMEGA128RFA1: ATmega128RFA1 8-bit AVR Microcontroller with Low Power 2.4GHz Transceiver for ZigBee and IEEE 802.15.4; DATASHEET: http://www.microchip.com/mymicrochip/filehandler.aspx?ddocname=en590262; DIST: Digikey; DISTLINK: https://www.digikey.com/products/en?keywords=ATMEGA128RFA1-ZU-ND; DISTPN: ATMEGA128RFA1-ZU-ND; MFR: Microchip Technology; MPN: ATMEGA128RFA1-ZU
NOISE_BR NOISE_BR1 = _power_symbols:NET_BRIDGE
PWM_DRIVER = _special:PCA9685_16-CH_12-BIT_PWM-DRIVER; DATASHEET: https://www.nxp.com/docs/en/data-sheet/PCA9685.pdf; DIST: Digikey; DISTLINK: https://www.digikey.com/products/en?keywords=568-11925-1-ND; DISTPN: 568-11925-1-ND; MFR: NXP USA Inc.; MPN: PCA9685PW,118
R1 R10 R16 R39-R43 = _resistors:10KΩ; DATASHEET: http://www.yageo.com/NewPortal/yageodocoutput?fileName=/pdf/R-Chip/PYu-RC_51_RoHS_P_0.pdf; DIST: Digikey; DISTLINK: https://www.digikey.com/products/en?keywords=YAG1281CT-ND; DISTPN: YAG1281CT-ND; MFR: Yageo; MPN: RC0402JR-0710KP
R2 R3 = _resistors:1KΩ; DATASHEET: http://www.yageo.com/documents/recent/PYu-RC_Group_51_RoHS_L_9.pdf; DIST: Digikey; DISTLINK: https://www.digikey.com/products/en?keywords=311-1.0KJRCT-ND; DISTPN: 311-1.0KJRCT-ND; MFR: Yageo; MPN: RC0402JR-071KL
R17 R18 = _resistors:4.7KΩ; DATASHEET: http://www.samsungsem.com/kr/support/product-search/chip-resistor/RCS1005J472CS.jsp; DIST: Digikey; DISTLINK: https://www.digikey.com/products/en?keywords=1276-7028-1-ND; DISTPN: 1276-7028-1-ND; MFR: Samsung Electro-Mechanics; MPN: RCS1005J472CS
RX_LED = _leds:LED; DATASHEET: https://www.bivar.com/portals/0/products/SM0402RC.pdf; DIST: Digikey; DISTLINK: https://www.digikey.com/products/en?keywords=492-2208-1-ND; DISTPN: 492-2208-1-ND; MFR: Bivar Inc.; MPN: SM0402RC
SERVO_INDEX SERVO_MIDDLE SERVO_PINKY SERVO_RING SERVO_THUMB = _motors:SERVO; DATASHEET: N/A; DATASHEET_CONNECTOR: P(G,R,A)xCxxSxxN Drawing, Straight; DIST: HobbyKing; DISTLINK: https://hobbyking.com/en_us/hobbykingtm-coreless-digital-hv-mg-bb-servo-20kg-0-16sec-66g.html?___store=en_us; DISTLINK_CONNECTOR: https://www.digikey.com/products/en?keywords=S1012E-03-ND; DISTPN: HK15298B; DISTPN_CONNECTOR: S1012E-03-ND; DIST_CONNECTOR: Digikey; MFR: HobbyKing; MFR_CONNECTOR: Sullins Connector Solutions; MPN: HK15298B; MPN_CONNECTOR: PEC03SAAN
SW1 = _switches:SWITCH_SPDT; DATASHEET: http://spec_sheets.e-switch.com/specs/T111597.pdf; DIST: Digikey; DISTLINK: https://www.digikey.com/products/en?keywords=EG2355-ND; DISTPN: EG2355-ND; MFR: E-Switch; MPN: 100SP1T1B4M2QE
TEMP_INDEX TEMP_MIDDLE TEMP_PINKY TEMP_RING TEMP_THUMB = _sensors:TEMPERATURE-SENSOR_TMP36; DATASHEET: https://www.analog.com/media/en/technical-documentation/data-sheets/TMP35_36_37.pdf; DATASHEET_CONNECTOR: https://www.molex.com/pdm_docs/sd/530470310_sd.pdf; DATASHEET_CRIMP: https://www.molex.com/pdm_docs/sd/500798000_sd.pdf; DATASHEET_HOUSING: https://www.molex.com/pdm_docs/sd/510210700_sd.pdf; DIST: Digikey; DISTLINK: https://www.digikey.com/products/en?keywords=TMP36GT9Z-ND; DISTLINK_CONNECTOR: https://www.digikey.com/products/en?keywords=WM1732-ND; DISTLINK_CRIMP: https://www.digikey.com/products/en?keywords=WM1142CT-ND; DISTLINK_HOUSING: https://www.digikey.com/products/en?keywords=0510210300; DISTPN: TMP36GT9Z-ND; DISTPN_CONNECTOR: WM1732-ND; DISTPN_CRIMP: WM1142CT-ND; DISTPN_HOUSING: 0510210300; DIST_CONNECTOR: Digikey; DIST_CRIMP: Digikey; DIST_HOUSING: Digikey; MFR: Analog Devices Inc.; MFR_CONNECTOR: Molex, LLC; MFR_CRIMP: Molex, LLC; MFR_HOUSING: Molex, LLC; MPN: TMP36GT9Z; MPN_CONNECTOR: 0530470310; MPN_CRIMP: 0500798000; MPN_HOUSING: 0510210300
TX_LED = _leds:LED; DATASHEET: https://www.bivar.com/portals/0/products/SM0402GC.pdf; DIST: Digikey; DISTLINK: https://www.digikey.com/products/en?keywords=492-2205-1-ND; DISTPN: 492-2205-1-ND; MFR: Bivar Inc.; MPN: SM0402GC
VREG-ANALOG = _ic_power:VREG_LINEAR_MCP1700: MCP1700 Voltage Regulator Series; DATASHEET: http://ww1.microchip.com/downloads/en/DeviceDoc/20001826D.pdf; DIST: Digikey; DISTLINK: https://www.digikey.com/products/en?keywords=MCP1700T1802ETTCT-ND; DISTPN: MCP1700T1802ETTCT-ND; MFR: Microchip Technology; MPN: MCP1700T-1802E/TT
VREG-MCU = _ic_power:VREG_TPS768XX_ULDO_FAST-TRANSIENT; DATASHEET: http://www.ti.com/lit/ds/symlink/tps768.pdf; DIST: Digikey; DISTLINK: https://www.digikey.com/products/en?keywords=296-46395-1-ND; DISTPN: 296-46395-1-ND; MFR: Texas Instruments; MPN: TPS76833QDR
VREG-SERVOS = _ic_power:VREG_MIC29501-5.0_LINEAR_ULDO_5A-5V; DATASHEET: http://ww1.microchip.com/downloads/en/DeviceDoc/20005685A.pdf; DIST: Digikey; DISTLINK: https://www.digikey.com/products/en?keywords=576-2240-ND; DISTPN: 576-2240-ND; MFR: Microchip Technology; MPN: MIC29501-5.0WU
Y1 = _crystals_oscillators_resonators:CRYSTAL: Various standard crystals. Proven footprints.; DATASHEET: https://abracon.com/Resonators/abm3b.pdf; DIST: Digikey; DISTLINK: https://www.digikey.com/products/en?keywords=535-9122-1-ND; DISTPN: 535-9122-1-ND; MFR: Abracon LLC; MPN: ABM3B-16.000MHZ-B2-T

## Net classes
0 default: width 0.127 mm, drill 0.254 mm, clearance 0.127 mm
1 vcc: width 0.254 mm, drill 0.254 mm, clearance 0.127 mm
3 ASIG: width 0.254 mm
4 DGND: width 0.254 mm

## Board
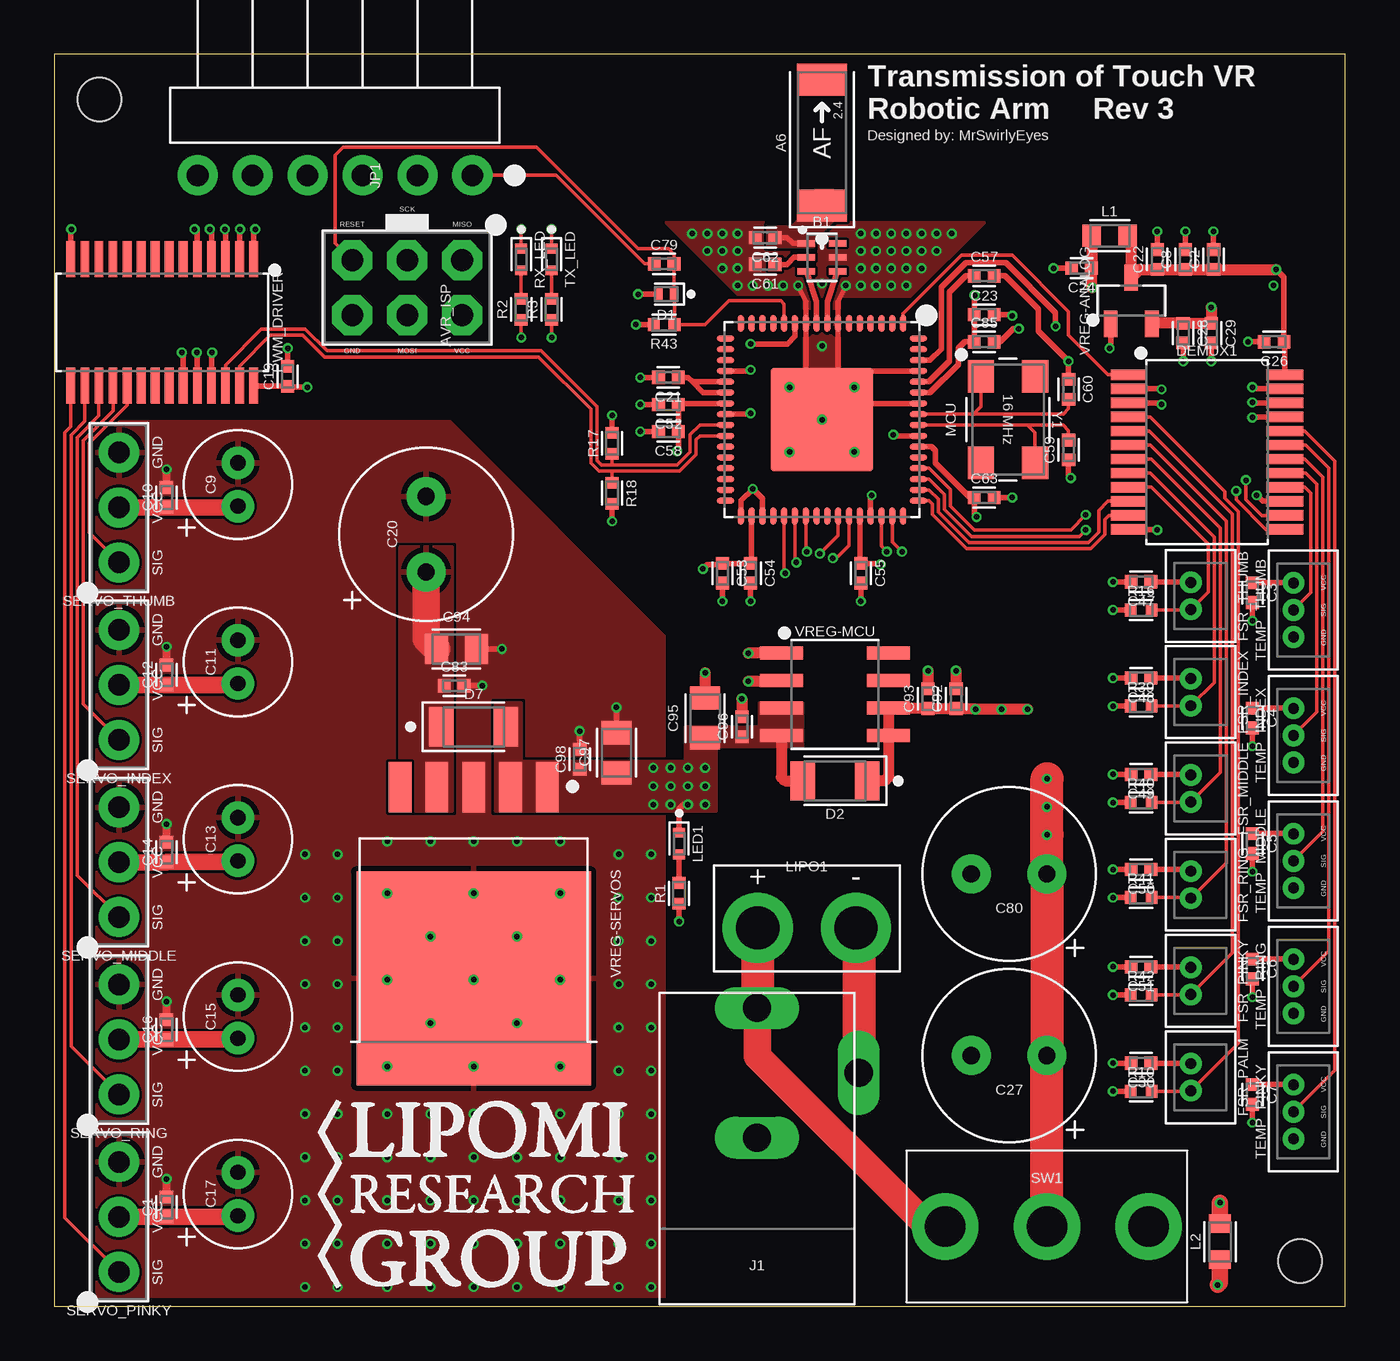
[diagram p3: board, top side]
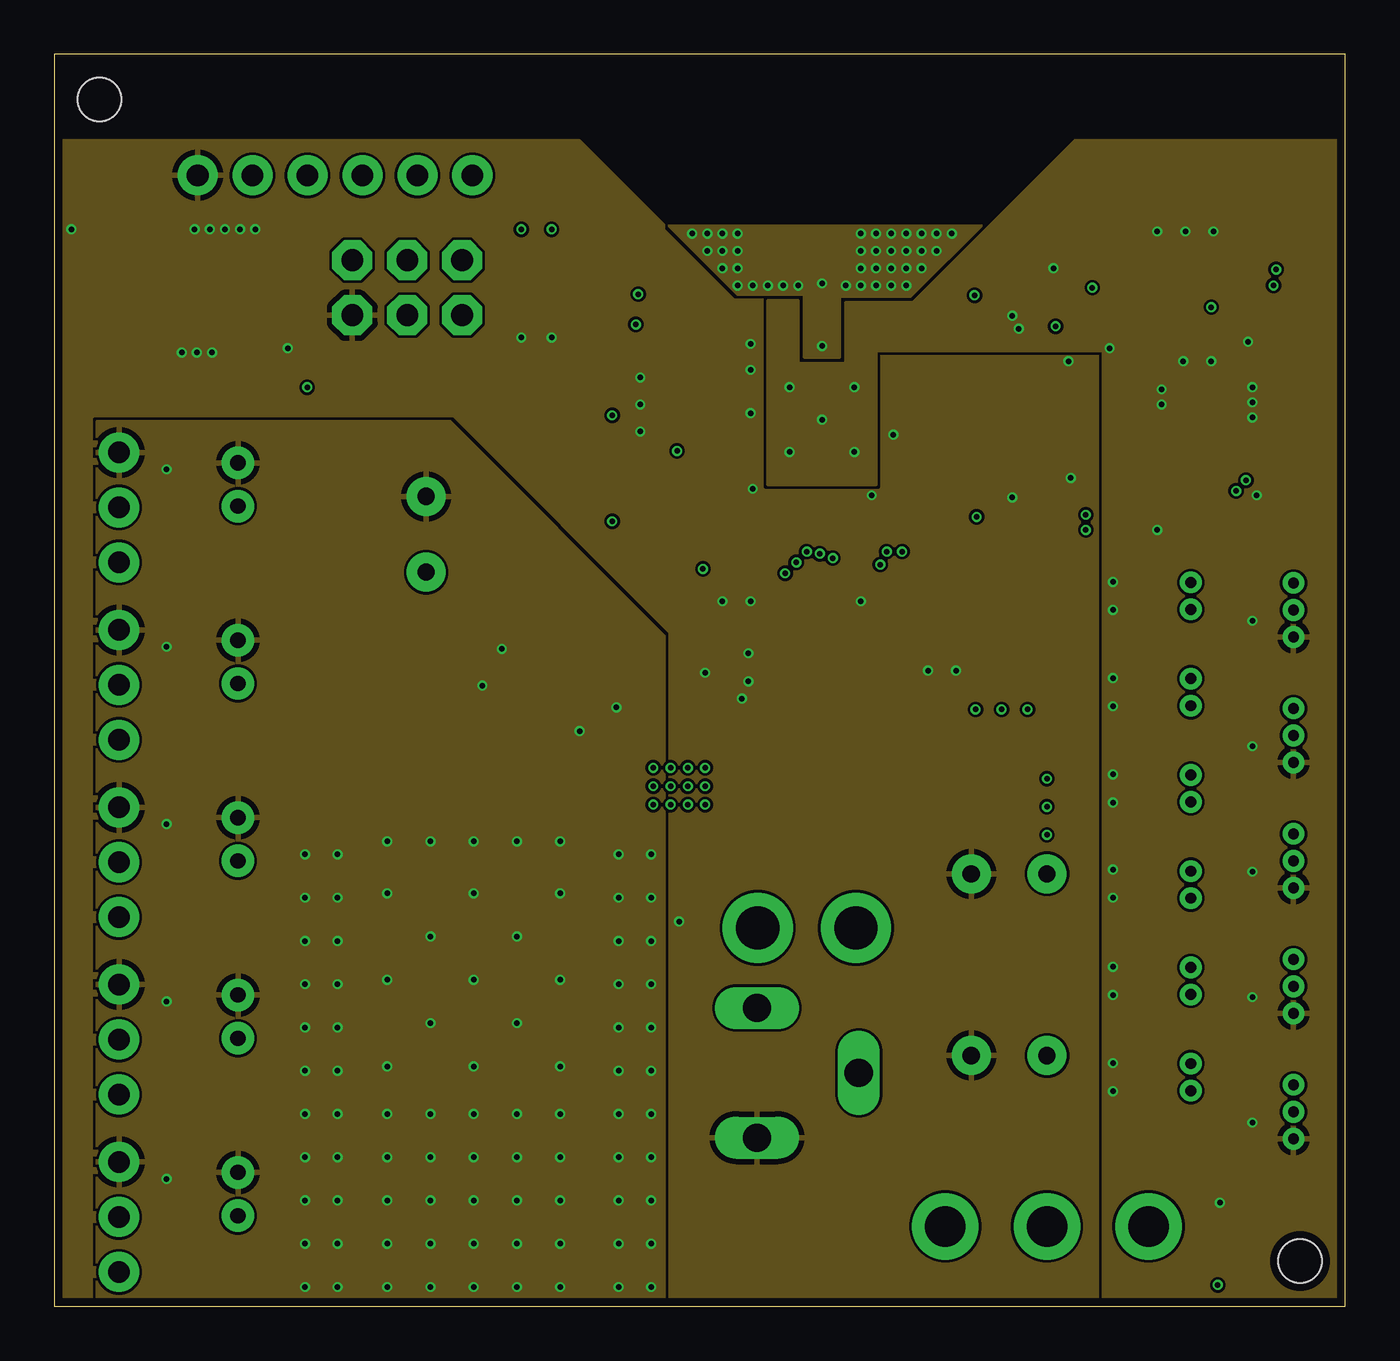
[diagram p4: board, inner layer Route2]
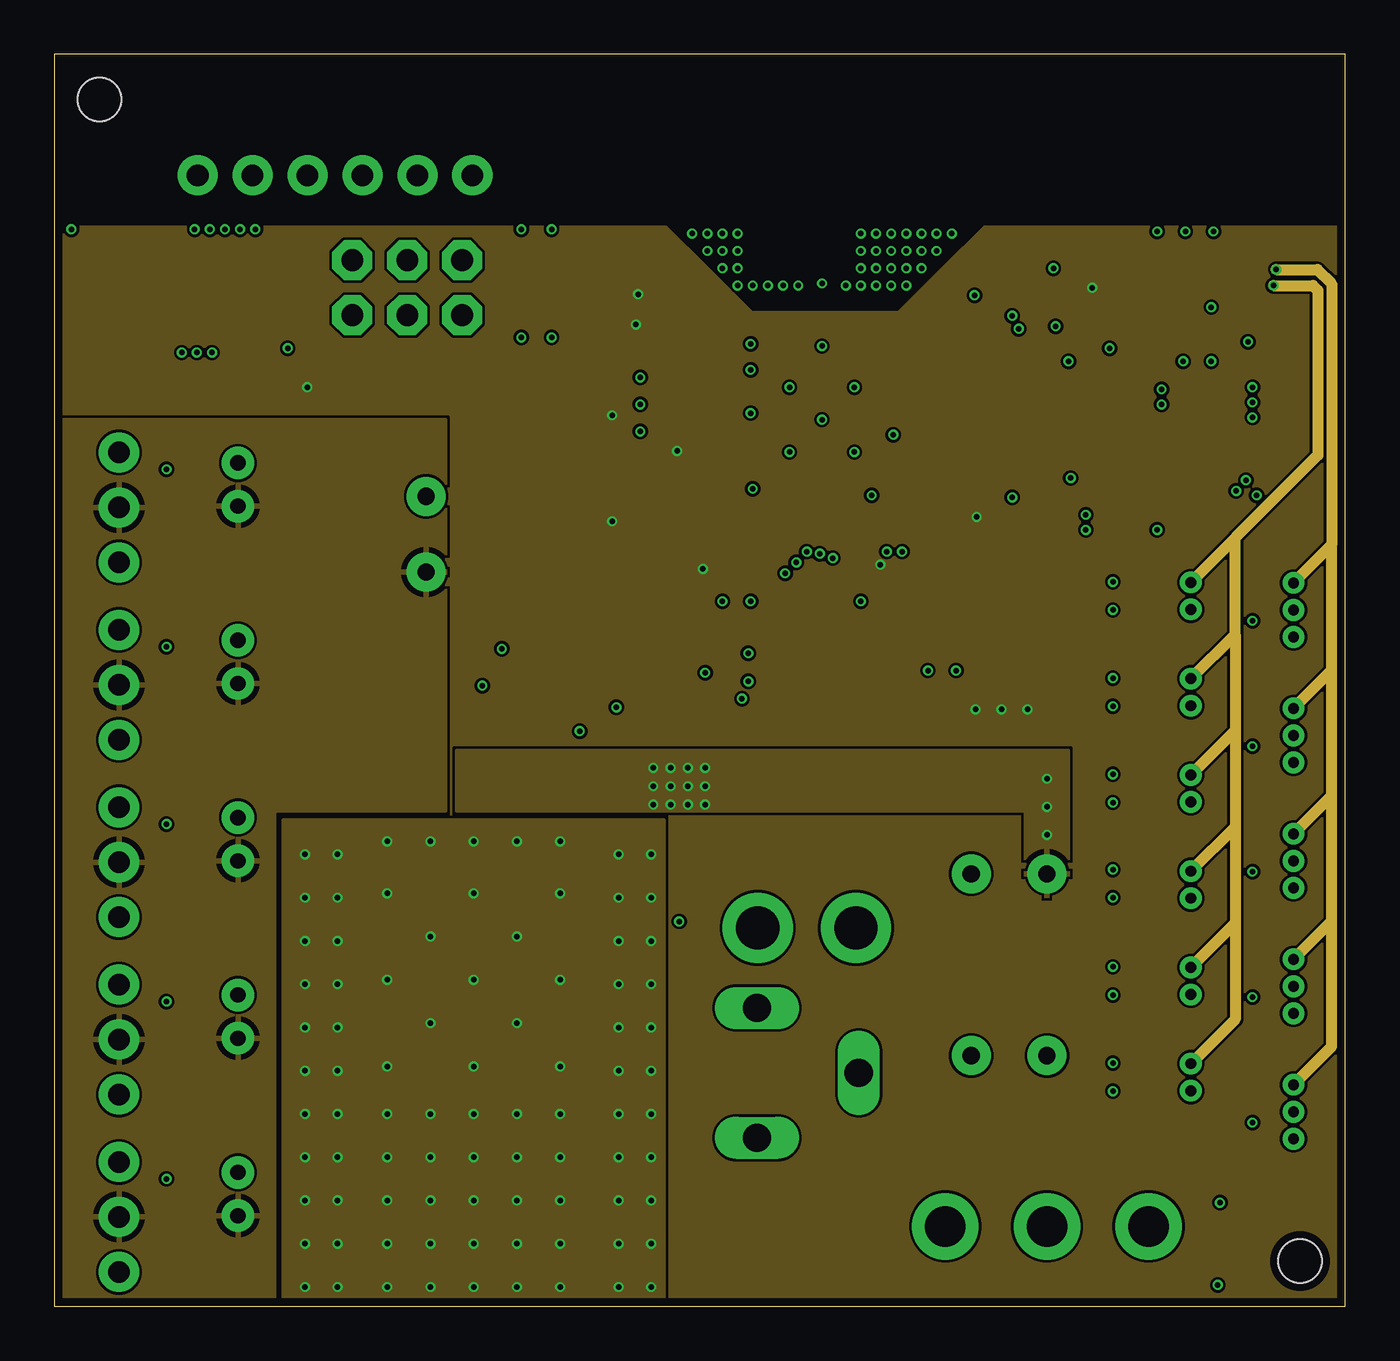
[diagram p5: board, inner layer Route15]
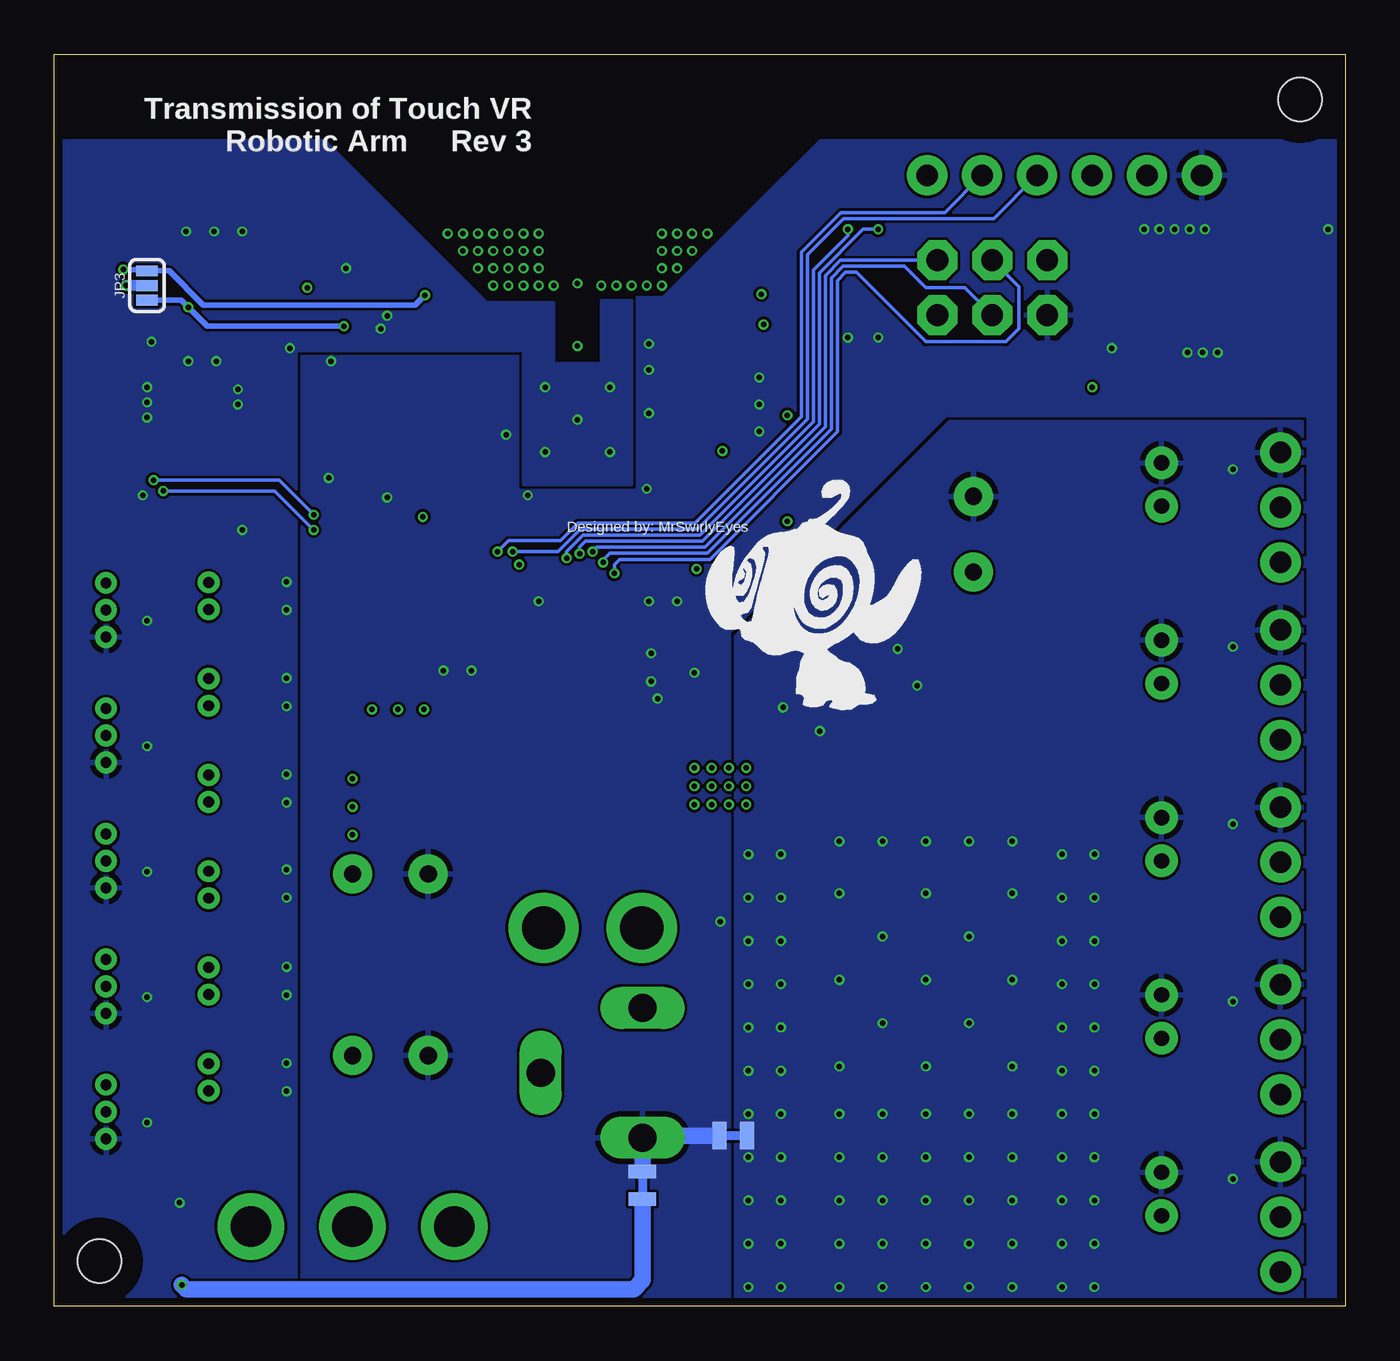
[diagram p6: board, bottom side, seen from below]

Size 59.7 x 57.9 mm. Coordinates in mm from the lower left corner, seen from the top.
Outline: 0,57.9 0,0 59.7,0 59.7,57.9 0,57.9
Copper layers (1*2*15*16): Top 0.035559375mm / dielectric 0.17018125mm / Route2 0.01778125mm / dielectric 47mil / Route15 0.01778125mm / dielectric 0.17018125mm / Bottom 0.035559375mm
Design rules "oshpark-4layer": minimum track width 5mil, minimum drill 10mil, track to track 5mil, track to pad 5mil, pad to pad 5mil, via to via 5mil, smd to smd 5mil, copper to edge 15mil, drill to drill 6mil, minimum pad ring 4mil, minimum via ring 4mil, stop-mask expansion 2.5mil, vias tented up to drill 0mil, thermal gap 10mil

### Footprints (pad centres in the part's own frame; a part is rotated, then mirrored left to right if it is on the bottom)
ANTC6522X100 = smd 1.478 x 2.312: 1 -2.917,0 | smd 1.482 x 2.312: 2 2.915,0
HDRV6W64P254_2X3_762X508X838B = drill 1 pad 1.85 octagon: GND 2.54,1.27; MISO -2.54,-1.27; MOSI 0,1.27; RESET 2.54,-1.27; SCK 0,-1.27; VCC -2.54,1.27
RESCAXE65P200X125X95-6 = smd 0.818 x 0.289: 1 -0.73,0.65; 2 -0.73,0; 3 -0.73,-0.65; 4 0.73,-0.65; 5 0.73,0; 6 0.73,0.65
CAPC1005X55_SMD-0402 = smd 0.585 x 0.612: 1 -0.458,0; 2 0.458,0
CAPPRD200W50D500H1100B = drill 0.7 pad 1.5: A -1,0; K 1,0
CAPPRD350W60D800H2000B = drill 0.8 pad 1.8: A -1.75,0; K 1.75,0
CAPC2012X95_SMD-0805 = smd 1.065 x 1.379: 1 -0.925,0; 2 0.925,0
DFN100X60X55-2 = smd 0.41 x 0.55: A -0.37,0; K 0.37,0
SODFL3516X170 = smd 1.136 x 1.815: A -1.489,0; K 1.489,0
SOP65P780X200-24 = smd 1.702 x 0.475: 1 -3.603,3.575; 2 -3.603,2.925; 3 -3.603,2.275; 4 -3.603,1.625; 5 -3.603,0.975; 6 -3.603,0.325; 7 -3.603,-0.325; 8 -3.603,-0.975; 9 -3.603,-1.625; 10 -3.603,-2.275; 11 -3.603,-2.925; 12 -3.603,-3.575; 13 3.603,-3.575; 14 3.603,-2.925; 15 3.603,-2.275; 16 3.603,-1.625; 17 3.603,-0.975; 18 3.603,-0.325; 19 3.603,0.325; 20 3.603,0.975; 21 3.603,1.625; 22 3.603,2.275; 23 3.603,2.925; 24 3.603,3.575
_MOLEX-0530470210_VERT_PITCH-1.25MM = drill 0.5 pad 1: 1 -0.625,0; 2 0.625,0
POWER_JACK_PTH_ID2.1MM-OD5.5MM = drill 1.3 long: GND_BATTERY 4.7,0; GND_JACK 0,-3; PWR 0,3
HDRRA6W64P254_1X6_1524X254X254B_FTDI = drill 1 pad 1.85: CTS 3.81,0; DTR -6.35,0; GND 6.35,0; RXI -3.81,0; TXO -1.27,0; VCC 1.27,0
SMT-JUMPER_3_NO_SILK = smd 0.5 x 1: 1 -0.678,0; 2 0,0; 3 0.678,0
INDC1608X60-0603 = smd 0.859 x 1.015: 1 -0.828,0; 2 0.828,0
LEDC1005X40_LED-0402 = smd 0.454 x 0.554: A -0.5,0; K 0.5,0
1X02_WIRE_CONNECTOR_AWG-18 = drill 2 pad 3.25: + -2.27,0; - 2.27,0
QFN50P900X900X90-64 = smd 0.812 x 0.282: 1 -4.45,3.75; 2 -4.45,3.25; 3 -4.45,2.75; 4 -4.45,2.25; 5 -4.45,1.75; 6 -4.45,1.25; 7 -4.45,0.75; 8 -4.45,0.25; 9 -4.45,-0.25; 10 -4.45,-0.75; 11 -4.45,-1.25; 12 -4.45,-1.75; 13 -4.45,-2.25; 14 -4.45,-2.75; 15 -4.45,-3.25; 16 -4.45,-3.75; 33 4.45,-3.75; 34 4.45,-3.25; 35 4.45,-2.75; 36 4.45,-2.25; 37 4.45,-1.75; 38 4.45,-1.25; 39 4.45,-0.75; 40 4.45,-0.25; 41 4.45,0.25; 42 4.45,0.75; 43 4.45,1.25; 44 4.45,1.75; 45 4.45,2.25; 46 4.45,2.75; 47 4.45,3.25; 48 4.45,3.75 | smd 0.282 x 0.812: 17 -3.75,-4.45; 18 -3.25,-4.45; 19 -2.75,-4.45; 20 -2.25,-4.45; 21 -1.75,-4.45; 22 -1.25,-4.45; 23 -0.75,-4.45; 24 -0.25,-4.45; 25 0.25,-4.45; 26 0.75,-4.45; 27 1.25,-4.45; 28 1.75,-4.45; 29 2.25,-4.45; 30 2.75,-4.45; 31 3.25,-4.45; 32 3.75,-4.45; 49 3.75,4.45; 50 3.25,4.45; 51 2.75,4.45; 52 2.25,4.45; 53 1.75,4.45; 54 1.25,4.45; 55 0.75,4.45; 56 0.25,4.45; 57 -0.25,4.45; 58 -0.75,4.45; 59 -1.25,4.45; 60 -1.75,4.45; 61 -2.25,4.45; 62 -2.75,4.45; 63 -3.25,4.45; 64 -3.75,4.45 | smd 4.75 x 4.75: EP 0,0 | drill 0.254: P$1 -1.5,1.5; P$2 1.5,1.5; P$3 1.5,-1.5; P$4 -1.5,-1.5; P$5 0,0
NET_BRIDGE = smd 0.635 x 1.27: P$1 -0.635,0; P$2 0.635,0
SOP65P650X110-28 = smd 1.659 x 0.407: 1 -2.926,4.225; 2 -2.926,3.575; 3 -2.926,2.925; 4 -2.926,2.275; 5 -2.926,1.625; 6 -2.926,0.975; 7 -2.926,0.325; 8 -2.926,-0.325; 9 -2.926,-0.975; 10 -2.926,-1.625; 11 -2.926,-2.275; 12 -2.926,-2.925; 13 -2.926,-3.575; 14 -2.926,-4.225; 15 2.926,-4.225; 16 2.926,-3.575; 17 2.926,-2.925; 18 2.926,-2.275; 19 2.926,-1.625; 20 2.926,-0.975; 21 2.926,-0.325; 22 2.926,0.325; 23 2.926,0.975; 24 2.926,1.625; 25 2.926,2.275; 26 2.926,2.925; 27 2.926,3.575; 28 2.926,4.225
RESC1005X35_SMD-0402 = smd 0.535 x 0.6: 1 -0.482,0; 2 0.482,0
HDRV3W64P254_1X3_762X254X838B = drill 1 pad 1.85: GND 5.08,0; SIG 0,0; VCC 2.54,0
SW_TOGGLE_SPDT_5A-28V_13L-7W = drill 1.875 pad 3.075: P 0,0; S1 0,-4.7; S2 0,4.7
_MOLEX-0530470310_VERT_PITCH-1.25MM = drill 0.5 pad 1: GND 1.25,0; SIG 0,0; VCC -1.25,0
HOLE_2MM = hole 2: 0,0
SOT95P237X112-3_SOT-23-3 = smd 1.224 x 0.625: 1 -1.064,0.95; 2 -1.064,-0.95; 3 1.064,0
SOIC127P600X265-8 = smd 1.968 x 0.599: 1 -2.473,1.905; 2 -2.473,0.635; 3 -2.473,-0.635; 4 -2.473,-1.905; 5 2.473,-1.905; 6 2.473,-0.635; 7 2.473,0.635; 8 2.473,1.905
TO170P1363X457-6 = smd 2.333 x 1.048: 1 -6.311,3.404; 2 -6.311,1.702; 3 -6.311,0; 4 -6.311,-1.702; 5 -6.311,-3.404 | smd 9.885 x 10.84: TAB 2.535,0
OSCCC500X320X110_CRYSTAL = smd 1.512 x 1.212: 1 -2,-1.25; 2 2,-1.25; 3 2,1.25; 4 -2,1.25

### Placement (x,y rotation side)
A6  35.5,53.8 90 top
AVR_ISP  16.32,47.1 180 top
B1  35.5,48.5 0 top
C1  5.2,4.6 90 top
C2  53.6,48.4 90 top
C3  55.4,33 270 top
C4  55.4,27.2 270 top
C5  55.4,21.4 270 top
C6  55.4,15.6 270 top
C7  55.4,9.8 270 top
C8  52.3,48.4 90 top
C9  8.5,38 90 top
C10  5.2,37.4 90 top
C11  8.5,29.8 90 top
C12  5.2,29.2 90 top
C13  8.5,21.6 90 top
C14  5.2,21 90 top
C15  8.5,13.4 90 top
C16  5.2,12.8 90 top
C17  8.5,5.2 90 top
C19  10.8,43 90 top
C20  17.2,35.7 90 top
C21  28.4,42.95 180 top
C22  51,48.4 90 top
C23  43,45.85 0 top
C24  47.5,48 180 top
C26  56.4,44.6 180 top
C27  44.15,11.6 180 top
C28  52.2,45 270 top
C29  53.5,45 270 top
C30  50.25,11.25 180 top
C47  50.25,33.5 180 top
C48  50.25,29.05 180 top
C49  50.25,24.6 180 top
C50  50.25,20.2 180 top
C51  50.25,15.7 180 top
C52  28.4,41.7 180 top
C53  30.9,33.9 270 top
C54  32.2,33.9 270 top
C55  37.3,33.9 270 top
C57  43,47.65 0 top
C58  28.4,40.45 180 top
C59  46.9,39.6 90 top
C60  46.9,42.4 270 top
C61  32.87,48.18 180 top
C62  32.87,49.41 180 top
C63  43,37.4 0 top
C79  28.2,48.2 0 top
C80  44.15,20 180 top
C83  18.5,28.7 0 top
C85  43,44.6 0 top
C92  41.7,28.1 90 top
C93  40.4,28.1 90 top
C94  18.6,30.4 0 top
C95  30.1,27.2 90 top
C96  31.8,26.8 90 top
C97  26,25.6 90 top
C98  24.3,25.3 90 top
D1  28.3,46.8 180 top
D2  36.1,24.3 180 top
D7  19.4,26.8 0 top
DEMUX1  53.3,39.5 0 top
FSR_INDEX  52.55,28.4 270 top
FSR_MIDDLE  52.55,23.95 270 top
FSR_PALM  52.55,10.6 270 top
FSR_PINKY  52.55,15.05 270 top
FSR_RING  52.55,19.5 270 top
FSR_THUMB  52.55,32.85 270 top
J1  32.5,10.8 0 top
JP1  12.99,52.29 180 top
JP3  55.4,47.2 90 bottom
L1  48.8,49.5 0 top
L2  53.9,3 90 top
LED1  28.9,21.4 270 top
LIPO1  34.8,17.5 0 top
MCU  35.5,41 270 top
NOISE_BR  28.3,7.9 180 bottom
NOISE_BR1  32.5,5.6 270 bottom
PWM_DRIVER  5,45.5 270 top
R1  28.9,19.1 90 top
R2  21.6,46.1 90 top
R3  23,46.1 90 top
R10  50.25,9.95 0 top
R16  50.25,32.2 0 top
R17  25.8,39.9 90 top
R18  25.8,37.6 270 top
R39  50.25,27.75 0 top
R40  50.25,23.3 0 top
R41  50.25,18.9 0 top
R42  50.25,14.4 0 top
R43  28.2,45.4 180 top
RX_LED  21.6,48.4 270 top
SERVO_INDEX  3,26.2 90 top
SERVO_MIDDLE  3,18 90 top
SERVO_PINKY  3,1.6 90 top
SERVO_RING  3,9.8 90 top
SERVO_THUMB  3,34.4 90 top
SW1  45.9,3.7 270 top
TEMP_INDEX  57.3,26.4 270 top
TEMP_MIDDLE  57.3,20.6 270 top
TEMP_PINKY  57.3,9 270 top
TEMP_RING  57.3,14.8 270 top
TEMP_THUMB  57.3,32.2 270 top
TX_LED  23,48.4 270 top
U$17  [HOLE_2MM]  57.6,2.1 270 top
U$18  [HOLE_2MM]  2.1,55.8 270 top
U$20  [MRSWIRLYEYES-LOGO]  24.6,32.9 0 bottom
U$21  [LRG-LOGO]  19.5,5.2 0 top
VREG-ANALOG  49.8,46.5 90 top
VREG-MCU  36.1,28.3 0 top
VREG-SERVOS  19.4,17.7 270 top
Y1  44.1,41 270 top

### Tracks (layer width: path | path; a pad name or v marks a point on that pad's centre or on a via)
3.3V  (via drill 0.25)
  Top 0.254: R43.2 v26.9,45.4 | D1.K v27,46.8 | MCU.23 28.91,41.75 C52.1 C58.1 28.86,39.61 v28.8,39.55 | MCU.34 32.25,34.41 C54.1 C53.1 30.84,34.3 30.2,34.3 v30,34.1 | MCU.54 40.55,39.75 40.74,39.56 40.74,39 42.34,37.4 C63.1 42.54,36.61 v42.65,36.5 | MCU.44 37.25,34.41 C55.1 38.14,34.36 v38.2,34.3 | R17.2 v25.8,41.2 | R18.2 v25.8,36.3 | v11.7,42.5 10.84,42.5 C19.1 9.26,42.54 PWM_DRIVER.28
  Top 0.508: D2.A 38.4,24.3 38.57,24.47 VREG-MCU.5 VREG-MCU.6 40.38,27.66 C93.1 C92.1 42.56,27.64 v42.6,27.6 v43.8,27.6 v45,27.6 | L1.1 47.97,48.01 C24.1 47.96,47.14 v48,47.1
  pour Route15 (rank 6): 59.7,0 59.7,49.9 0,49.9 0,0
5V
  Top 0.762: SERVO_THUMB.VCC C10.1 8.46,36.94 C9.A | SERVO_INDEX.VCC C12.1 8.46,28.74 C11.A | SERVO_MIDDLE.VCC C14.1 8.46,20.54 C13.A | SERVO_RING.VCC C16.1 8.46,12.34 C15.A | SERVO_PINKY.VCC C1.1 | C1.1 | C17.A 8.46,4.14 C1.1
  Top 1.27: C20.A 17.2,30.88 C94.1
  pour Route15: 18.1,22.9 18.1,41 0,41 0,0 10.2,0 10.2,22.9
  pour Top: 18.4,22.9 16,22.9 16,35.1 18.4,35.1
+
  Top 1.27: J1.PWR 32.53,13.83 32.53,11.57 40.4,3.7 SW1.S1
  Top 1.524: LIPO1.+ 32.53,13.83
-
  Top 1.524: LIPO1.- 37.2,17.37 J1.GND_BATTERY
A1.8V  (via drill 0.25)
  Top 0.254: MCU.62 40.5,43.75 41.02,44.27 41.02,47.12 42.15,48.25 44,48.25 46.3,45.95 v46.3,45.32
  Top 0.508: VREG-ANALOG.2 50.75,45.46 C28.1 C29.1 v53.5,46.2
  Bottom 0.254: v46.3,45.32 52.62,45.32 v53.5,46.2 53.82,46.52 JP3.1
A3.3V  (via drill 0.25)
  Top 0.254: MCU.59 40.5,42.25 41.8,43.55 41.8,44.3 42.1,44.6 C85.1 C23.1 v42.54,46.74 v42.55,46.75 | C3.1 TEMP_THUMB.VCC | C4.1 TEMP_INDEX.VCC | C6.1 TEMP_RING.VCC | TEMP_PINKY.VCC C7.1 | C5.1 TEMP_MIDDLE.VCC | DEMUX1.24 56.9,44.55 C26.1 56.86,47.59 v56.5,47.94
  Top 0.508: L1.2 49.8,49.33 VREG-ANALOG.3 50.18,47.94 C22.1 C8.1 C2.1 v56.5,47.94
  Route15 0.508: TEMP_PINKY.VCC 59.06,12.02 59.06,17.8 | 59.06,17.8 59.06,23.6 | 59.06,23.6 59.06,29.4 | 59.06,29.4 59.06,35.2 | TEMP_RING.VCC 59.05,17.8 59.06,17.8 | TEMP_MIDDLE.VCC 59.05,23.6 59.06,23.6 | TEMP_INDEX.VCC 59.05,29.4 59.06,29.4 | TEMP_THUMB.VCC 59.05,35.2 59.06,35.2 | v56.5,47.94 58.4,47.94 59.06,47.28 59.06,35.2
  Bottom 0.254: v42.55,46.75 43,46.3 52.8,46.3 54.38,47.88 JP3.3 55.47,47.94 v56.5,47.94
AGND  (via drill 0.25, 0.25 pad 0.25)
  Top 0.254: C47.2 v48.95,33.5 | R16.1 v48.95,32.2 | C48.2 v48.95,29.05 | R39.1 v48.95,27.75 | C49.2 v48.95,24.6 | R40.1 v48.95,23.3 | C50.2 v48.95,20.2 | R41.1 v48.95,18.9 | C51.2 v48.95,15.7 | R42.1 v48.95,14.4 | C3.2 v55.4,31.7 | C4.2 v55.4,25.9 | C5.2 v55.4,20.1 | C6.2 v55.4,14.3 | C7.2 v55.4,8.5 | DEMUX1.15 55.88,37.23 v55.6,37.5 | DEMUX1.12 50.98,35.92 v51,35.9 | DEMUX1.2 51.17,42.42 v51.2,42.4 | DEMUX1.3 51.12,41.77 v51.2,41.7 | DEMUX1.23 55.48,42.42 v55.4,42.5 | DEMUX1.22 55.42,41.77 v55.4,41.8 | DEMUX1.21 55.42,41.12 v55.4,41.1 | C26.2 v55.2,44.6 | v44.6,45.2 44.36,45.2 43.76,44.6 C85.2 | v51,49.7 C22.2 | v52.3,49.7 C8.2 | MCU.P$4 34.75,43.25 MCU.10 34.75,46.45 v34.4,47.2 | MCU.P$1 36.25,43.25 MCU.7 36.25,46.46 v36.6,47.2 | MCU.58 37.75,41.75 MCU.P$1 | MCU.61 37.75,43.25 MCU.P$1 | VREG-ANALOG.1 48.85,44.3 v48.8,44.3 | C29.2 v53.5,43.7 | C28.2 v52.2,43.7 | C24.2 v46.2,48 | C30.2 v48.95,11.25 | R10.1 v48.95,9.95 | C2.2 v53.6,49.7 | v44.3,45.8 44.25,45.85 C23.2
  Top 0.762: L2.2 v53.9,4.8
  other vias: 31.6,49.6 37.3,48.8 35.5,47.3 33.7,47.2 33,47.2 32.3,47.2 31.6,48.8 30.9,49.6 30.9,48.8 30.9,48 30.2,48.8 30.2,49.6 29.5,49.6 31.6,47.2 37.3,48 37.3,49.6 37.3,47.2 38,47.2 38.7,47.2 39.4,47.2 38,48 38,48.8 38,49.6 38.7,49.6 38.7,48.8 38.7,48 39.4,49.6 39.4,48.8 39.4,48 40.1,48 40.1,48.8 40.1,49.6 40.8,48.8 40.8,49.6 41.5,49.6 31.6,48 35.5,44.4
  pour Route2 (rank 3): 36.3,43.9 36.3,46.7 39.6,46.7 43,50.1 28.3,50.1 31.6,46.8 34.7,46.8 34.7,43.9
  pour Top (rank 3): 36.3,42.9 36.3,46.7 39.6,46.7 43,50.1 28.3,50.1 31.6,46.8 34.7,46.8 34.7,42.9
  pour Route2: 48.5,0 59.7,0 59.7,53.9 47.2,53.9 39.7,46.4 36.6,46.4 36.6,43.6 34.4,43.6 34.4,46.5 33,46.5 33,38 38,38 38,44.2 48.5,44.2
  pour Bottom: 48.5,0 59.7,0 59.7,53.9 47.2,53.9 39.7,46.4 36.6,46.4 36.6,43.6 34.4,43.6 34.4,46.5 33,46.5 33,38 38,38 38,44.2 48.5,44.2
FSR_INDEX
  Top 0.152: R39.2 52.52,27.75 FSR_INDEX.2 53.63,28.85 53.63,35.57 50.67,38.52 DEMUX1.8
FSR_MIDDLE
  Top 0.152: R40.2 52.52,23.3 FSR_MIDDLE.2 53.91,24.68 53.91,35.99 50.73,39.17 DEMUX1.7
FSR_PALM
  Top 0.152: DEMUX1.4 50.67,41.12 54.12,37.68 54.12,37.38 54.75,36.75 54.75,12.17 FSR_PALM.2 52.52,9.95 R10.2
FSR_PINKY
  Top 0.152: R42.2 52.52,14.4 FSR_PINKY.2 54.47,16.34 54.47,36.63 50.62,40.48 DEMUX1.5
FSR_RING
  Top 0.152: R41.2 52.52,18.9 FSR_RING.2 54.19,20.51 54.19,36.31 50.67,39.83 DEMUX1.6
FSR_THUMB
  Top 0.152: R16.2 52.52,32.2 FSR_THUMB.2 53.35,33.02 53.35,35.25 50.72,37.88 DEMUX1.9
GND  (via drill 0.25, 0.25 pad 0.25)
  Top 0.152: v21.6,44.8 R2.1 | v23,44.8 R3.1
  Top 0.254: PWM_DRIVER.1 9.22,49.73 v9.3,49.8 | PWM_DRIVER.2 8.57,49.77 v8.6,49.8 | v7.9,49.8 7.92,49.77 PWM_DRIVER.3 | v7.2,49.8 7.28,49.73 PWM_DRIVER.4 | v6.5,49.8 6.62,49.67 PWM_DRIVER.5 | PWM_DRIVER.14 0.78,49.77 v0.8,49.8 | C19.2 v10.8,44.3 | C59.1 46.9,38.4 v47,38.3 | C60.1 v46.9,43.7 45.5,45.1 45.5,46.1 43.95,47.65 C57.2 | v44.3,37.4 C63.2 | PWM_DRIVER.25 7.28,44.08 v7.3,44.1 | v6.6,44.1 6.62,44.08 PWM_DRIVER.24 | v5.9,44.1 5.97,44.02 PWM_DRIVER.23 | C54.2 v32.2,32.6 | C53.2 v30.9,32.6 | R1.1 v28.9,17.8 | C52.2 v27.1,41.7 | C21.2 v27.1,42.95 | C58.2 v27.1,40.45 | MCU.55 38.85,40.25 v38.8,40.3 | MCU.45 37.75,37.45 v37.8,37.5 | MCU.33 31.75,37.25 v32.3,37.8 32.75,37.35 MCU.35 | MCU.24 32.15,41.25 v32.2,41.3 | MCU.20 32.15,43.25 v32.2,43.3 | C55.2 v37.3,32.6 | MCU.11 34.25,44.85 33.9,44.5 v32.2,44.5
  Top 0.508: VREG-MCU.1 v32.1,30.2 | VREG-MCU.2 33.59,28.9 v32.1,28.9 | v31.8,28.1 C96.2 | v30.1,29.3 C95.2 | v41.7,29.4 C92.2 | v40.4,29.4 C93.2
  Bottom 0.762: NOISE_BR.P$2 32.4,7.9 J1.GND_JACK NOISE_BR1.P$1
  pour Route2 (rank 6): 59.7,0 59.7,53.9 0,53.9 0,0
  cutout Route2: 20.5,57.9 28.3,50.1 43,50.1 50.8,57.9
  cutout Route15: 20.5,57.9 32.3,46.1 39,46.1 50.8,57.9
  pour Bottom (rank 6): 59.7,0 59.7,53.9 0,53.9 0,0
  cutout Bottom: 20.5,57.9 31.6,46.8 39.7,46.8 50.8,57.9
MISO  (via drill 0.25)
  Top 0.152: MCU.39 34.75,34.95 v34.8,34.9
  Bottom 0.152: v34.8,34.9 34.6,35.1 29.61,35.1 24.04,40.67 24.04,47.66 23.34,48.37 AVR_ISP.MISO
MOSI  (via drill 0.25)
  Top 0.152: MCU.38 34.25,34.47 v34.32,34.4
  Bottom 0.152: v34.32,34.4 34.32,34.5 34,34.82 29.49,34.82 23.76,40.55 23.76,47.55 23.22,48.09 20.39,48.09 19.4,47.1 17.59,47.1 AVR_ISP.MOSI
N$1  (via drill 0.25)
  Top 0.762: L2.1 53.9,1.1 v53.8,1
  Bottom 0.762: NOISE_BR1.P$2 32.5,1.2 32.9,0.8 53.6,0.8 v53.8,1
N$2
  Top 0.254: LED1.K R1.2
N$3
  Top 0.152: R3.2 TX_LED.K
N$5
  Top 0.152: R2.2 RX_LED.K
N$10
  Top 0.254: 29.51,42.75 29.31,42.95 C21.1 | MCU.21 29.51,42.75 | MCU.22 30.01,42.25 29.51,42.75
N$11
  Top 0.254: MCU.60 40.45,42.75 41.4,43.7 41.4,46.9 42.15,47.65 C57.1
N$30
  Top 0.152: 42.5,41.25 MCU.57 | 42.5,41.25 46.65,41.25 46.9,41.5 C60.2 | Y1.1 42.85,41.6 42.5,41.25
N$32
  Top 0.254: MCU.9 35.25,46.45 34.82,47.8 B1.3
N$33
  Top 0.254: MCU.8 35.75,46.45 36.18,47.8 B1.4
N$34
  Top 0.254: B1.2 34.2,48.5 33.88,48.18 C61.1
N$35
  Top 0.152: 45,40.75 MCU.56 | C59.2 46.9,40.5 46.65,40.75 45,40.75 | 45,40.75 45.35,40.4 Y1.3
N$39
  Top 0.254: B1.1 34.15,49.15 33.89,49.41 C62.1
  pour Top: 35.2,51.6 34.4,50.2 34.1,49.9 33,49.9 33,49 35.1,49 35.1,49.3 36,50.2 36,51.6
N$41
  Top 0.152: JP1.DTR 23.21,52.29 27.3,48.2 C79.1
NGND  (via drill 0.25, 0.25 pad 0.25)
  Top 0.254: v19.8,28.7 C83.2 | v20.7,30.4 C94.2 | v26,27.7 C97.2 | v24.3,26.6 C98.2
  Top 0.381: C10.2 v5.2,38.7 | C12.2 v5.2,30.5 | C14.2 v5.2,22.3 | C16.2 v5.2,14.1 | C1.2 v5.2,5.9
  other vias: 19.4,8.9 21.4,8.9 23.4,8.9 17.4,8.9 15.4,8.9 19.4,21.5 17.4,21.5 15.4,21.5 21.4,21.5 23.4,21.5 26.1,14.9 26.1,16.9 26.1,18.9 26.1,12.9 26.1,10.9 13.1,14.9 13.1,16.9 13.1,18.9 13.1,12.9 13.1,10.9 19.4,6.9 19.4,4.9 19.4,2.9 19.4,0.9 13.1,20.9 26.1,20.9 26.1,8.9 26.1,6.9 26.1,4.9 26.1,2.9 26.1,0.9 13.1,8.9 13.1,6.9 13.1,4.9 13.1,2.9 13.1,0.9 15.4,6.9 15.4,4.9 15.4,2.9 15.4,0.9 17.4,6.9 17.4,4.9 17.4,2.9 17.4,0.9 21.4,6.9 21.4,4.9 21.4,2.9 21.4,0.9 23.4,6.9 23.4,4.9 23.4,2.9 23.4,0.9 27.6,20.9 27.6,18.9 27.6,16.9 27.6,14.9 27.6,12.9 27.6,10.9 27.6,8.9 27.6,6.9 27.6,4.9 27.6,2.9 27.6,0.9 11.6,0.9 11.6,2.9 11.6,4.9 11.6,6.9 11.6,8.9 11.6,10.9 11.6,12.9 11.6,14.9 11.6,16.9 11.6,18.9 11.6,20.9 19.4,15.1 23.4,15.1 23.4,19.1 23.4,11.1 19.4,11.1 15.4,11.1 15.4,15.1 15.4,19.1 19.4,19.1 21.4,17.1 21.4,13.1 17.4,17.1 17.4,13.1
  pour Route2: 2,0 2,40.9 18.3,40.9 28.2,31 28.2,0
  pour Bottom: 2,40.9 2,0 28.2,0 28.2,31 18.3,40.9
  pour Route15 (rank 5): 10.6,22.5 10.6,0 28.2,0 28.2,22.5
  pour Top (rank 5): 10.6,22.5 10.6,0 28.2,0 28.2,22.5 20.1,22.5 20.1,25.6 18.7,25.6 18.7,22.5
  pour Top (rank 2): 2,40.9 2,0 28.2,0 28.2,31 18.3,40.9
RESET
  Top 0.152: MCU.12 33.75,46.35 33.6,46.5 31.2,46.5 30.1,45.4 R43.1 28.68,46.79 D1.A 28.67,48.19 | 28.67,48.19 C79.2 | 28.67,48.19 28.67,48.63 28.4,48.9 27,48.9 22.3,53.6 13.37,53.6 13,53.23 13,49.15 AVR_ISP.RESET
RX  (via drill 0.25)
  Top 0.152: MCU.46 38.25,35.15 v38.5,34.9
  Bottom 0.152: v38.5,34.9 36.39,34.9 35.35,35.94 29.96,35.94 24.88,41.02 24.88,48.62 23.2,50.3 16.25,50.3 JP1.TXO
RX_LED  (via drill 0.25)
  Top 0.152: MCU.42 36.25,35.65 v35.4,34.8 | RX_LED.A v21.6,49.8
  Bottom 0.152: v35.4,34.8 35.4,35.1 35.12,35.38 29.73,35.38 24.32,40.78 24.32,47.78 22.3,49.8 v21.6,49.8
S0
  Top 0.152: MCU.50 40.45,37.75 40.88,37.32 40.88,36.73 42.29,35.32 47.82,35.32 48.3,35.8 48.3,36.8 48.73,37.23 DEMUX1.10
S1
  Top 0.152: MCU.49 40.45,37.25 40.6,37.1 40.6,36.62 42.18,35.04 47.94,35.04 48.58,35.68 48.58,36.38 48.77,36.58 DEMUX1.11
S2  (via drill 0.25)
  Top 0.152: v47.7,36.6 47,35.9 42.54,35.9 41.44,37 41.44,37.76 40.45,38.75 MCU.52 | v55.1,38.2 55.1,37.3 55.83,36.58 DEMUX1.14
  Bottom 0.152: v55.1,38.2 49.3,38.2 v47.7,36.6
S3  (via drill 0.25)
  Top 0.152: DEMUX1.13 56.02,35.92 54.65,37.3 v54.65,37.7 | v47.7,35.9 47.4,35.6 42.41,35.6 41.16,36.85 41.16,37.54 40.45,38.25 MCU.51
  Bottom 0.152: v54.65,37.7 49.5,37.7 v47.7,35.9
SCK  (via drill 0.25)
  Top 0.152: MCU.37 33.75,33.94 v33.8,33.9
  Bottom 0.152: v33.8,33.9 33.8,34.3 33.55,34.54 29.38,34.54 23.48,40.44 23.48,47.43 23.1,47.81 22.61,47.81 19.4,44.6 15.7,44.6 15.1,45.2 15.1,47.15 AVR_ISP.SCK
SCL
  Top 0.152: MCU.25 29.85,40.75 29.4,40.3 29.4,39.5 28.8,38.9 25.8,38.9 | 25.8,38.9 25.3,38.9 25.1,39.1 25.1,41.6 22.52,44.18 12.62,44.18 11.62,45.18 9.58,45.18 7.92,43.52 PWM_DRIVER.26 | R17.1 25.8,38.9
SDA
  Top 0.152: MCU.26 29.85,40.25 29.68,40.08 29.68,39.38 28.92,38.62 25.8,38.62 | R18.1 25.8,38.62 | PWM_DRIVER.27 8.57,43.48 10,44.9 11.5,44.9 12.5,43.9 22.41,43.9 24.82,41.48 24.82,38.98 25.18,38.62 25.8,38.62
SERVO_INDEX
  Top 0.152: SERVO_INDEX.SIG 1.34,27.86 1.34,40.04 2.73,41.42 PWM_DRIVER.18
SERVO_MIDDLE
  Top 0.152: SERVO_MIDDLE.SIG 1.06,19.94 1.06,40.16 2.08,41.17 PWM_DRIVER.17
SERVO_PINKY
  Top 0.152: SERVO_PINKY.SIG 0.5,4.1 0.5,40.4 0.78,40.67 PWM_DRIVER.15
SERVO_RING
  Top 0.152: SERVO_RING.SIG 0.78,12.02 0.78,40.28 1.43,40.92 PWM_DRIVER.16
SERVO_THUMB
  Top 0.152: SERVO_THUMB.SIG 1.62,35.78 1.62,39.92 3.38,41.67 PWM_DRIVER.19
SIG
  Top 0.152: DEMUX1.1 48.73,43.08 46.9,44.9 46.9,46 44.3,48.6 41.95,48.6 39.25,45.9 MCU.1
TEMP_INDEX
  Top 0.152: TEMP_INDEX.SIG 58.38,27.48 58.38,38.02 57.88,38.52 DEMUX1.17
TEMP_MIDDLE
  Top 0.152: TEMP_MIDDLE.SIG 58.66,21.96 58.66,38.34 57.83,39.17 DEMUX1.18
TEMP_PINKY
  Top 0.152: TEMP_PINKY.SIG 59.22,10.92 59.22,39.08 57.83,40.48 DEMUX1.20
TEMP_RING
  Top 0.152: TEMP_RING.SIG 58.94,16.44 58.94,38.76 57.88,39.83 DEMUX1.19
TEMP_THUMB
  Top 0.152: TEMP_THUMB.SIG 58.1,33 58.1,37.6 57.83,37.88 DEMUX1.16
TX  (via drill 0.25)
  Top 0.152: MCU.47 38.75,35.35 v39.2,34.9
  Bottom 0.152: v39.2,34.9 38.7,35.4 36.28,35.4 35.47,36.22 30.07,36.22 25.16,41.13 25.16,48.74 23.32,50.58 18.51,50.58 JP1.RXI
TX_LED  (via drill 0.25)
  Top 0.152: MCU.43 36.75,35.18 36.17,34.6 v36,34.6 | TX_LED.A v23,49.8
  Bottom 0.152: v36,34.6 36,34.9 35.24,35.66 29.84,35.66 24.6,40.9 24.6,47.9 23,49.5 v23,49.8
VBAT  (via drill 0.25)
  Top 0.254: LED1.A 28.9,23 29.1,23.2 v29.3,23.2
  Top 0.508: VREG-MCU.4 33.63,24.47 33.8,24.3 D2.K
  Top 1.524: v45.9,24.4 v45.9,23.1 v45.9,21.8 C80.A C27.A SW1.P
  other vias: 30.1,23.2 28.5,23.2 27.7,23.2 30.1,24.05 29.3,24.05 28.5,24.05 27.7,24.05 27.7,24.9 28.5,24.9 29.3,24.9 30.1,24.9
  pour Route15: 46.9,18.95 44.9,18.95 44.9,22.9 18.6,22.9 18.6,25.7 46.9,25.7
  pour Top: 20.4,22.9 20.4,27.9 21.6,27.9 21.6,25.2 29.2,25.2 29.2,26.8 32.6,26.8 32.6,27.9 34.6,27.9 34.6,25.9 30.6,25.9 30.6,22.9
VSENSOR  (via drill 0.25)
  Top 0.254: C51.1 52.52,15.7 FSR_PINKY.1 | C50.1 52.48,20.2 FSR_RING.1 | C49.1 52.52,24.6 FSR_MIDDLE.1 | C48.1 52.52,29.05 FSR_INDEX.1 | C47.1 52.52,33.5 FSR_THUMB.1 | C30.1 52.52,11.25 FSR_PALM.1
  Route15 0.508: v56.38,47.2 58.2,47.2 58.43,46.97 58.43,39.35 54.64,35.56 54.6,35.52 | 54.6,17.73 FSR_PINKY.1 | 54.6,31.07 54.6,26.62 | 54.6,26.62 54.6,22.18 | 54.6,22.18 54.6,17.73 | 54.6,17.73 54.6,13.28 FSR_PALM.1 | FSR_RING.1 54.6,22.18 | FSR_MIDDLE.1 54.6,26.62 | FSR_INDEX.1 54.6,31.07 | FSR_THUMB.1 54.6,35.52 | 54.6,31.07 54.6,35.52
  Bottom 0.508: JP3.2 v56.38,47.2

### Text on the board
tPlace: Transmission of Touch VR / Robotic Arm Rev 3 | Designed by: MrSwirlyEyes
bPlace: Transmission of Touch VR / Robotic Arm Rev 3 | Designed by: MrSwirlyEyes